# Altium project TC387_FOC.PrjPcb
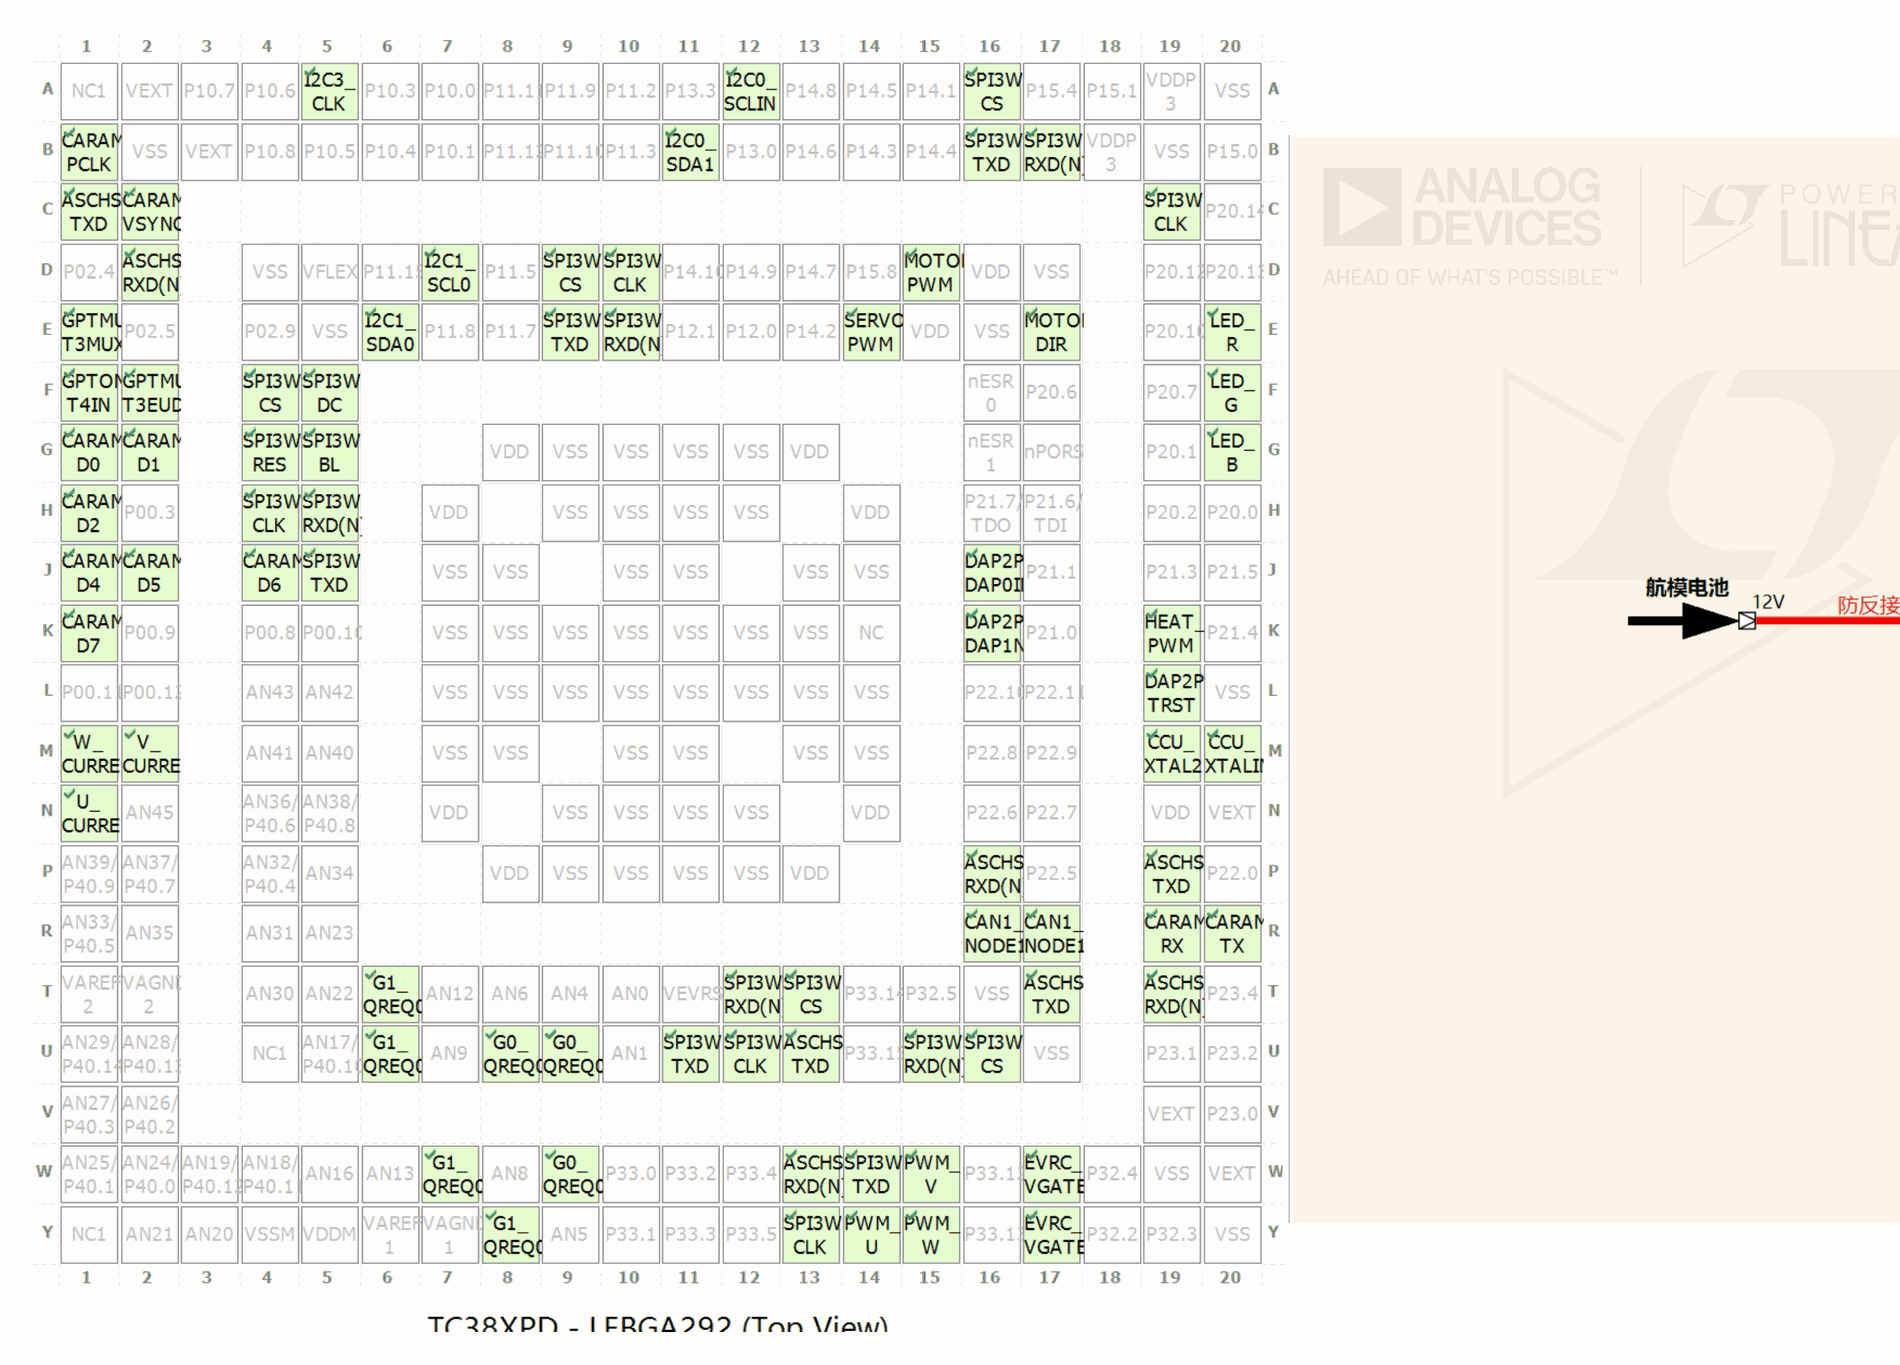
[diagram p0: TopDesign.SchDoc, left]
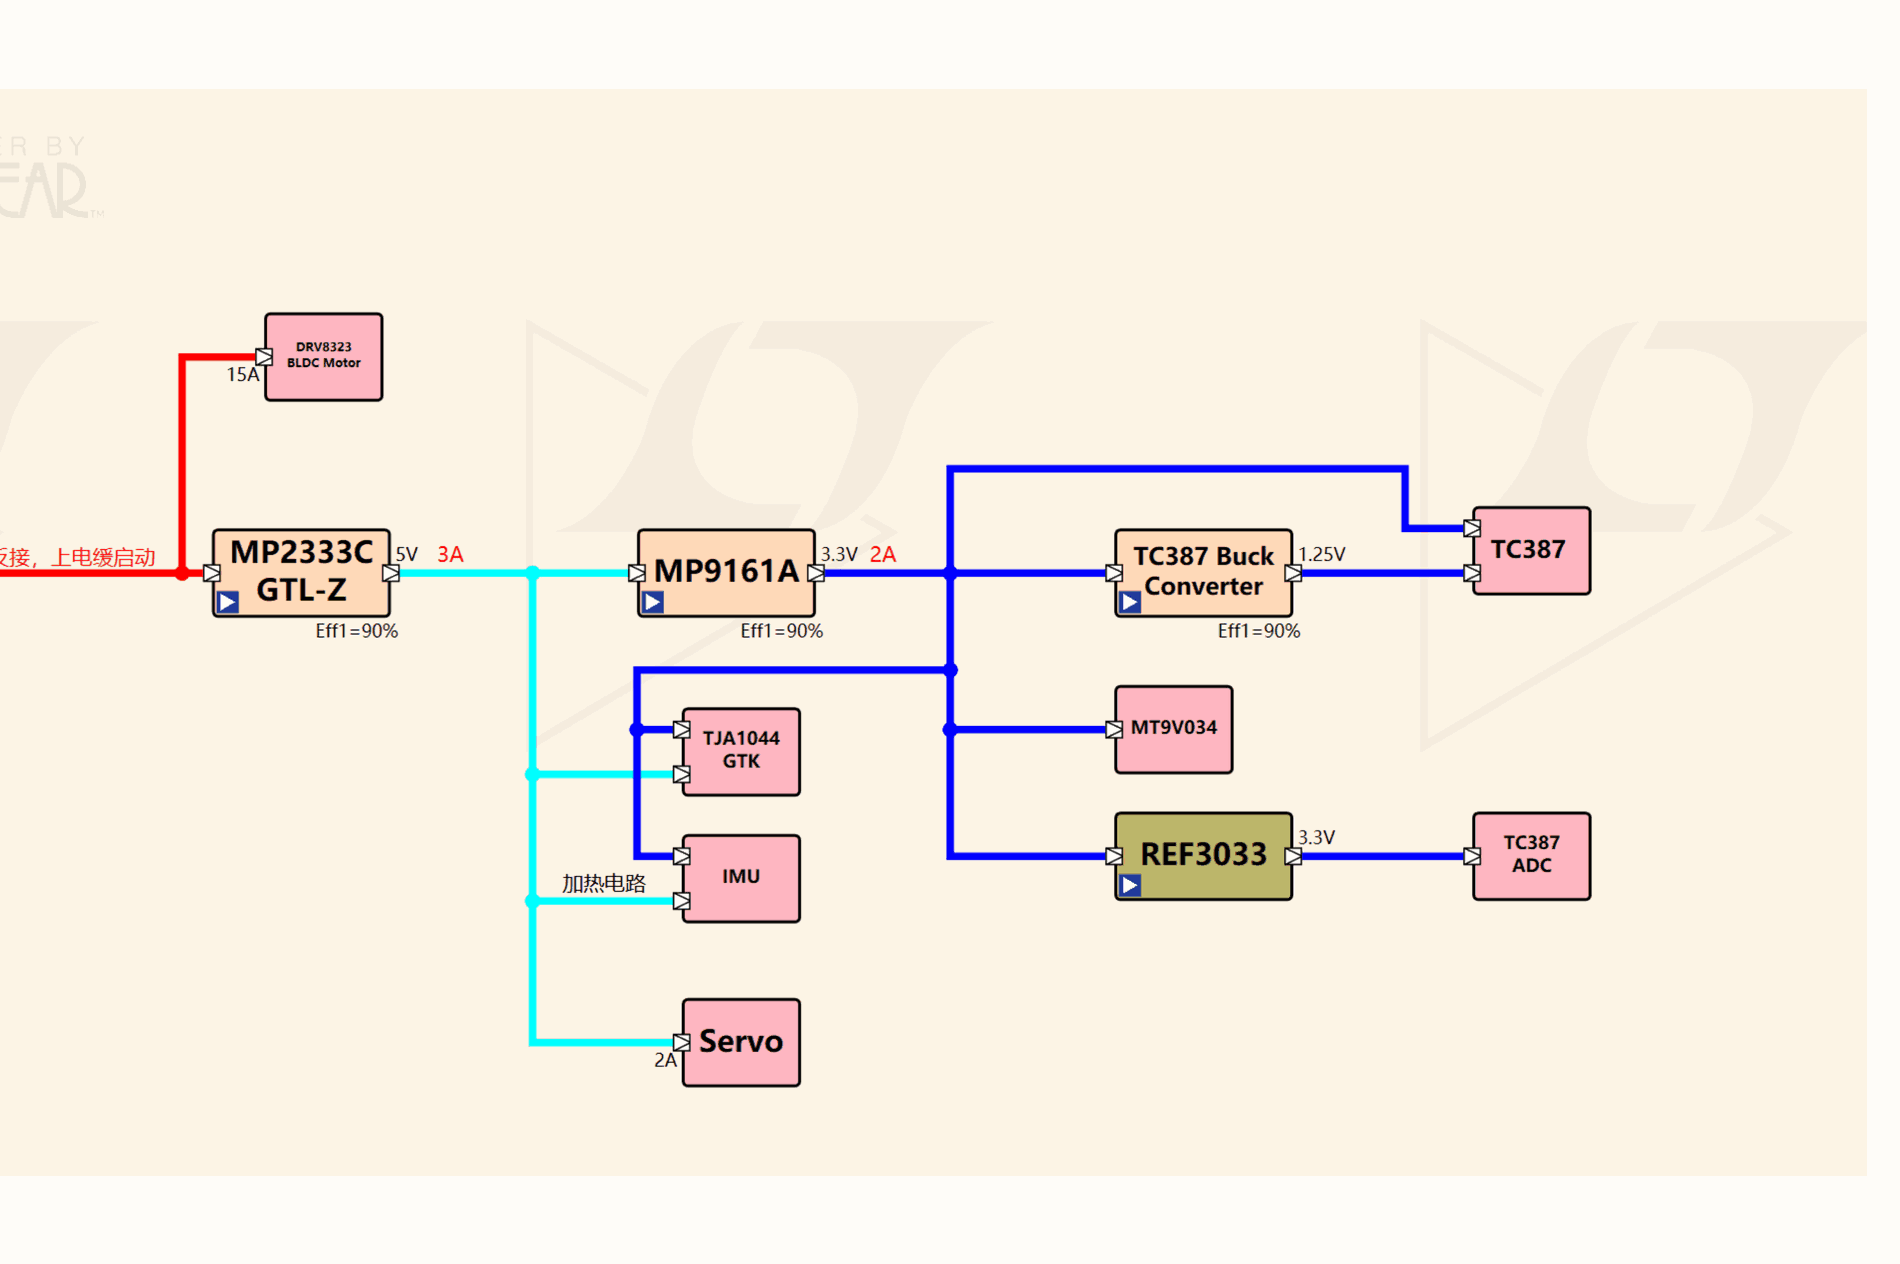
[diagram p1: TopDesign.SchDoc, right]
7 sheets, 210 parts. Net scope: global (net labels, ports and power ports of the same name join across sheets).
Board file: TC387_FOC.PcbDoc
Sheets:
  TopDesign.SchDoc
  PWR.SchDoc
  TC387_PWR.SchDoc
  TC387.SchDoc
  Carama.SchDoc
  Peripherals.SchDoc
  FOC.SchDoc

## Sheet TopDesign.SchDoc
size A1; SheetNumber: 4; SheetTotal: 6

## Sheet PWR.SchDoc
size A3; SheetNumber: 5; SheetTotal: 6
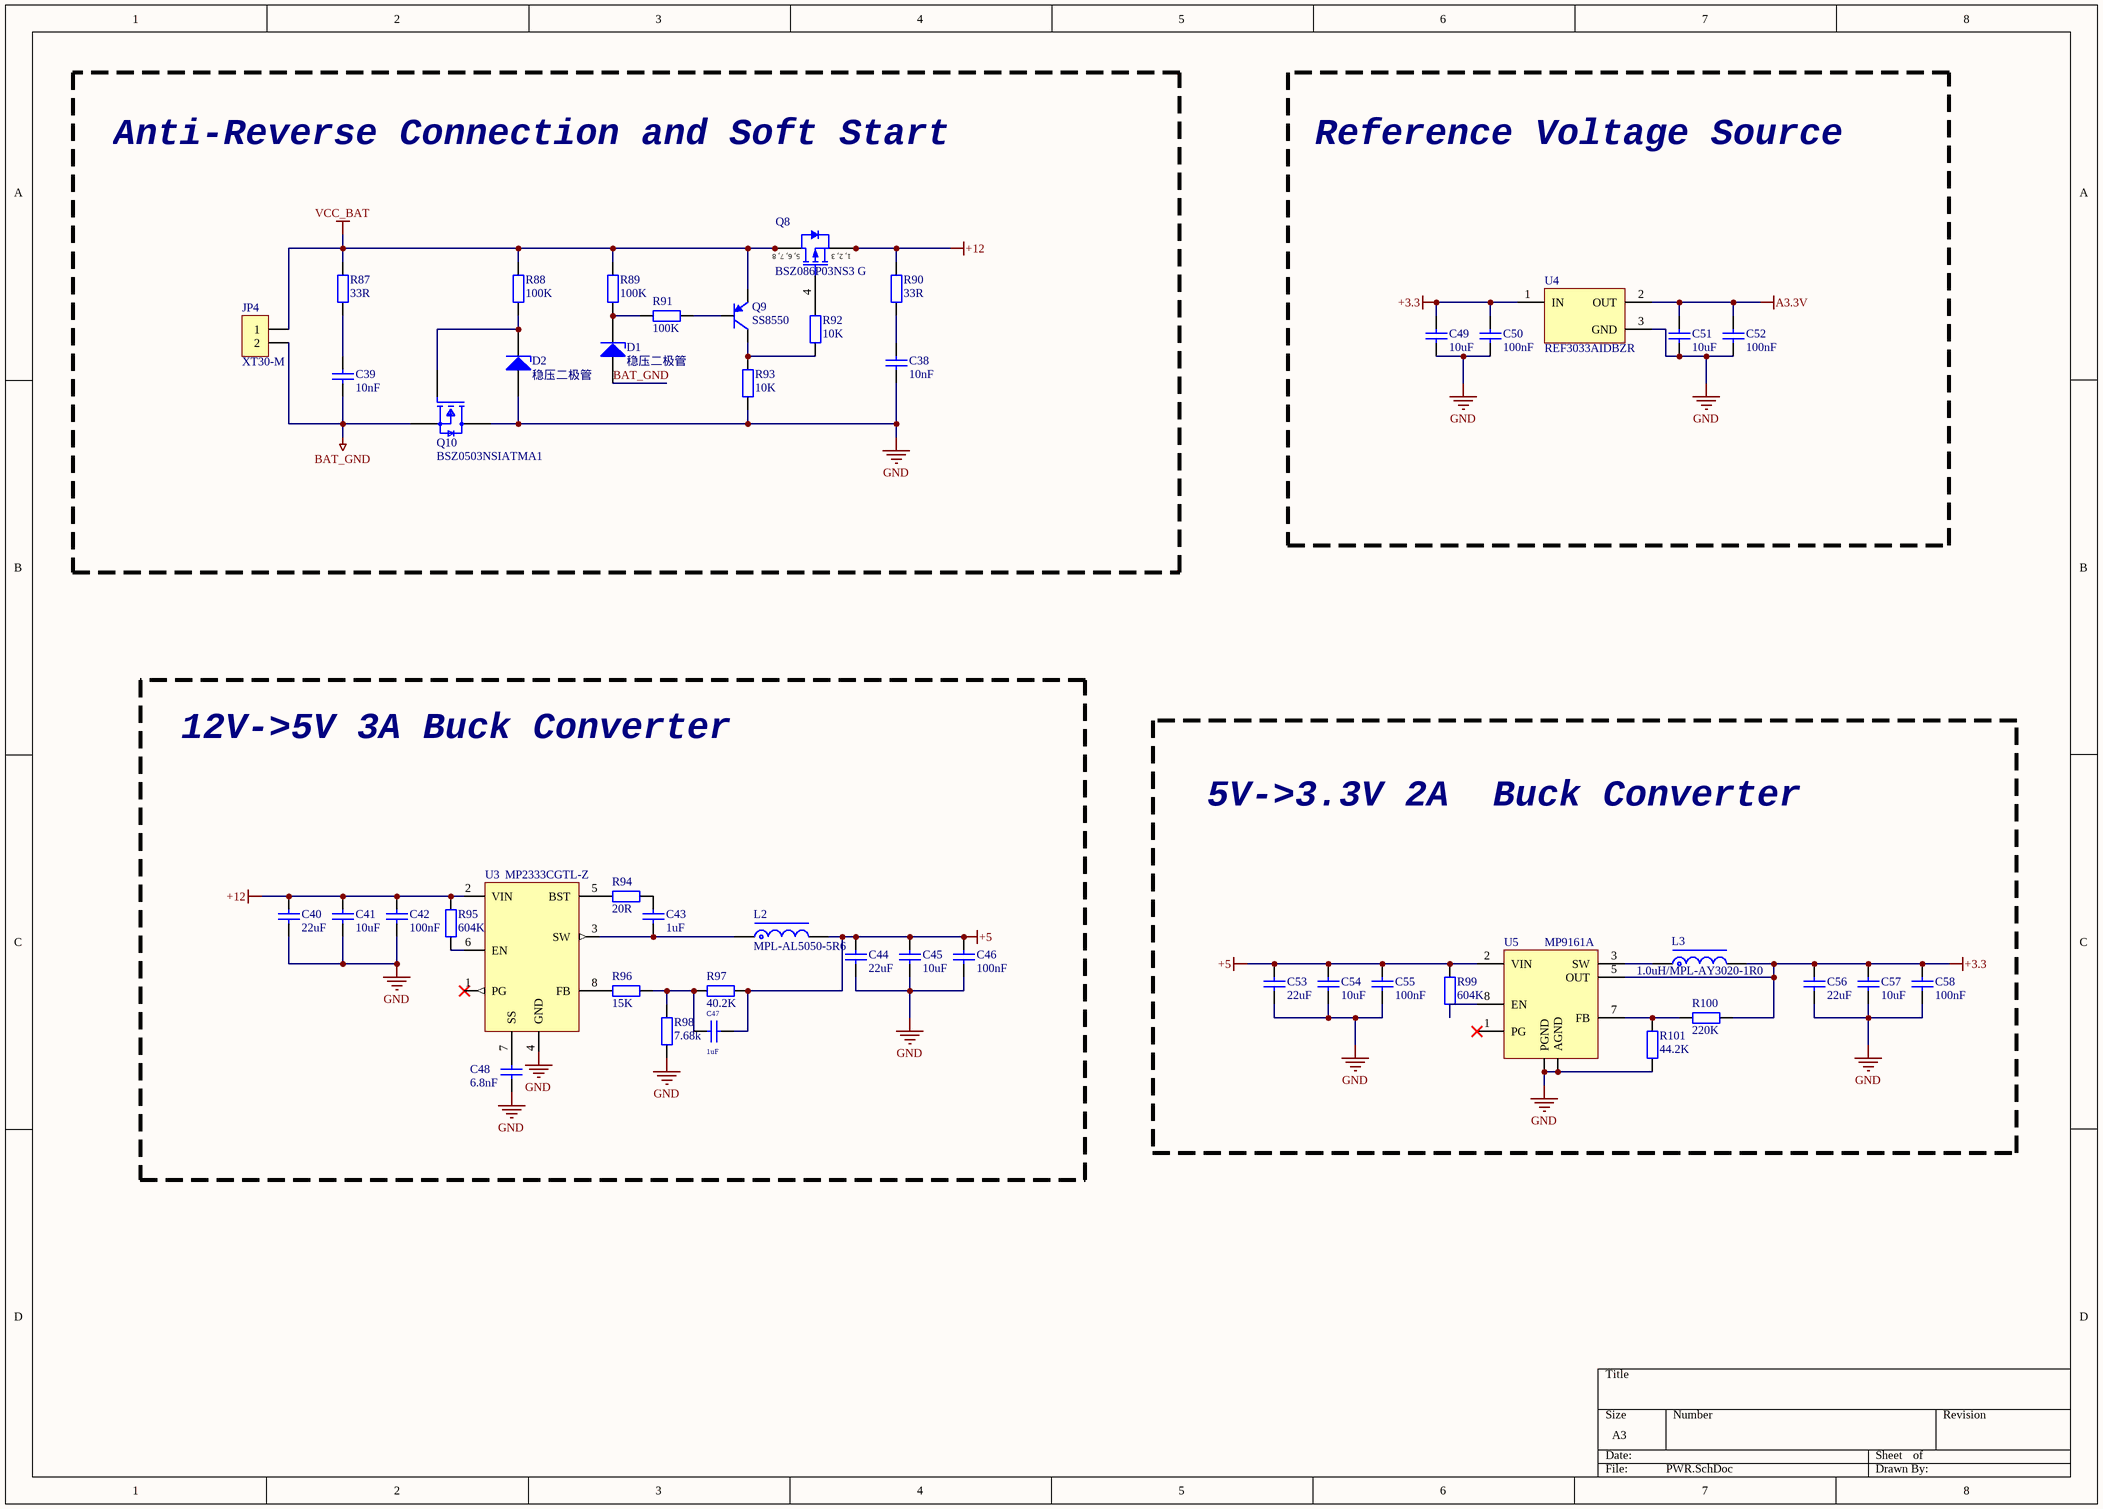
[diagram p2: PWR.SchDoc]

### Parts
C38  10nF  [C0402_M]
C39  10nF  [C0402_M]
C40  22uF  [C0402_M]
C41  10uF  [C0402_M]
C42  100nF  [C0402_M]
C43  1uF  [C0402_M]
C44  22uF  [C0402_M]
C45  10uF  [C0402_M]
C46  100nF  [C0402_M]
C47  1uF  [C0402_M]
C48  6.8nF  [C0402_M]
C49  10uF  [C0402_M]
C50  100nF  [C0402_M]
C51  10uF  [C0402_M]
C52  100nF  [C0402_M]
C53  22uF  [C0402_M]
C54  10uF  [C0402_M]
C55  100nF  [C0402_M]
C56  22uF  [C0402_M]
C57  10uF  [C0402_M]
C58  100nF  [C0402_M]
D1  稳压二极管  [SOD-523]
D2  稳压二极管  [SOD-523]
JP4  XT30-M  [XT30PB-M]
L2  MPL-AL5050-5R6  [MPL-AL5050]
L3  1.0uH/MPL-AY3020-1R0  [MPL-AY3020]
Q8  BSZ086P03NS3 G  [INF-PG-TSDSON-8-1_V]
Q9  SS8550  [SOT23-3N]
Q10  BSZ0503NSIATMA1  [FP-PG-TSDSON-8-MFG]
R87  33R  [R0402_L]
R88  100K  [R0402_L]
R89  100K  [R0402_L]
R90  33R  [R0402_L]
R91  100K  [R0402_L]
R92  10K  [R0402_L]
R93  10K  [R0402_L]
R94  20R  [R0402_L]
R95  604K  [R0402_L]
R96  15K  [R0402_L]
R97  40.2K  [R0402_L]
R98  7.68k  [R0402_L]
R99  604K  [R0402_L]
R100  220K  [R0402_L]
R101  44.2K  [R0402_L]
U3  MP2333CGTL-Z  [SOT583_MP2333C_MNP]
U4  REF3033AIDBZR  [DBZ0003A_N]
U5  MP9161A  [SOT23-8]

### Blocks framed on the sheet
Anti-Reverse Connection and Soft Start: C38 C39 D1 D2 JP4 Q8-Q10 R87-R93
Reference Voltage Source: C49-C52 U4
12V->5V 3A Buck Converter: C40-C48 L2 R94-R98 U3
5V->3.3V 2A  Buck Converter: C53-C58 L3 R99-R101 U5

### Nets
+3.3: C49.2 C50.2 C56.2 C57.2 C58.2 L3.2 R100.2 U4.1(IN) U5.5(OUT)
+5: C44.2 C45.2 C46.2 C47.1 C53.2 C54.2 C55.2 L2.2 R97.2 R99.2 U5.2(VIN)
+12: C40.2 C41.2 C42.2 Q8.1(SOURCE) Q8.2(SOURCE) Q8.3(SOURCE) R90.2 R95.2 U3.2(VIN)
A3.3V: C51.2 C52.2 U4.2(OUT)
BAT_GND: C39.1 D1.1(A) JP4.2 Q10.1-2-3(S)
GND: C38.1 C40.1 C41.1 C42.1 C44.1 C45.1 C46.1 C48.2 C49.1 C50.1 C51.1 C52.1 C53.1 C54.1 C55.1 C56.1 C57.1 C58.1 D2.1(A) Q10.5-6-7-8(D) R93.2 R98.2 R101.2 U3.4(GND) U4.3(GND) U5.4(PGND) U5.6(AGND)
VCC_BAT: JP4.1 Q8.5(DRAIN) Q8.6(DRAIN) Q8.7(DRAIN) Q8.8(DRAIN) Q9.2(E) R87.2 R88.2 R89.2
NetC38_2: C38.2 R90.1
NetC39_2: C39.2 R87.1
NetC43_1: C43.1 L2.1 U3.3(SW)
NetC43_2: C43.2 R94.1
NetC47_2: C47.2 R96.1 R97.1 R98.1
NetC48_1: C48.1 U3.7(SS)
NetD1_2: D1.2(K) R89.1 R91.2
NetD2_2: D2.2(K) Q10.4(G) R88.1
NetL3_1: L3.1 U5.3(SW)
NetQ8_4: Q8.4(GATE) R92.1
NetQ9_1: Q9.1(B) R91.1
NetQ9_3: Q9.3(C) R92.2 R93.1
NetR94_2: R94.2 U3.5(BST)
NetR95_1: R95.1 U3.6(EN)
NetR96_2: R96.2 U3.8(FB)
NetR99_1: R99.1 U5.8(EN)
NetR100_1: R100.1 R101.1 U5.7(FB)

Not connected (* = marked no-connect by the designer): U3 1(PG)*; U5 1(PG)*

### Notes on the sheet
- (in symbol CMP-1099-00063-1) 5, 6, 7, 8; 1, 2, 3

### Library data of the parts
C38-C58 = C: 贴片电容/MLCC电容; BOM名称: 无极性贴片电容; 当前库版本V2023.5.31 @淘宝卖家:黄晶宝石: 最新版本发布https://item.taobao.com/item.htm?id=566775463719
D1 D2 = 稳压二极管: Zener Diode; 当前库版本V2023.5.31 @淘宝卖家:黄晶宝石: 最新版本发布https://shop463601444.taobao.com
JP4 = XT30-M: XT30公头; 当前库版本V2023.5.31 @淘宝卖家:黄晶宝石: 最新版本发布https://shop463601444.taobao.com
L2 L3 = L-Molding Choke: 一体成型电感; 当前库版本V2023.5.31 @淘宝卖家:黄晶宝石: 最新版本发布https://item.taobao.com/item.htm?id=566775463719; BOM名称: 一体成型电感
Q8 = CMP-1099-00063-1: P-Channel OptiMOS P3 Power-Transistor, -30 V VDS, -40 A ID, -55 to 150 degC, PG-TSDSON-8-1, Reel, Green; Manufacturer: Infineon; RDS (on) (max): 8.6Â mOhm; Rth: 1.8Â K/W; QG: 43.2Â nC; VGS(th) (max): -1.9Â V; RthJC (max): 1.8 K/W; Green: TRUE; Pto t (max): 69Â W; ID (max): -40Â A; IDpuls (max): -160Â A; VDS (max): -30Â V; VGS(th) (min): -3.1Â V; ComponentLink1URL: http://www.infineon.com/; ComponentLink2URL: http://www.infineon.com/dgdl/BSZ086P03NS3+G_2.03.pdf?folderId=db3a304314dca38901154a7313d21a66&fileId=db3a30431ff9881501203d3a5e7d17a9; Mounting Technology: Surface Mount; PartNumber: BSZ086P03NS3 G; Packing: Reel; PackageVersion: Rev. 02, 09/2008; Halogen-free: TRUE; ComponentLink3URL: http://www.infineon.com/dgdl/BSZ240N12NS3+Rev2.0.pdf?folderId=db3a304313b8b5a60113cee8763b02d7&fileId=db3a30432a40a650012a42f3057a0038; PackageDescription: 8-Pin Plastic (Green) Thin Dual Small Outline Non-Leaded Package, 3.3 x 3.3 mm Body, 0.65 mm Pitch; PackageReference: PG-TSDSON-8-1; DatasheetVersion: Rev. 2.03; ComponentLink2Description: Datasheet; ComponentLink3Description: Package Specification; ComponentLink1Description: Manufacturer URL
Q9 = 8550-SMD: 高频放大-PNP型; 参数: 40V 1.5A 1W 100MHZ; 联系下单店铺卖家 免费帮你查找封装: 联系下单店铺卖家 免费技术支持; BOM名称: 高频放大-PNP型
Q10 = CMP-00066-1: BSZ0503NSI series 30V 40A 3.4 mOhm N-Ch S3O8 OptiMOS 5; Max Power Dissipation: 36W; Rds On Max: 3.4mR; Input Capacitance: 1.3nF; Mounting Technology: Surface Mount; Max Operating Temperature: 150°C; Halogen Free: Halogen Free; Series: OptiMOS™; Packaging: Tape and Reel; Pins: 8; Min Operating Temperature: -55°C; Drain to Source Voltage (Vdss): 30V; Lead Free: Contains Lead; Max Dual Supply Voltage: 30V; RoHS Compliant: Yes
R87-R101 = CMP-005-000000-2: 贴片电阻0; 联系下单店铺卖家 免费帮你查找封装: 联系下单店铺卖家 免费技术支持; BOM名称: 贴片电阻; Source: 0.1 - 电阻-电容-电感-保险丝-晶振-晶体-磁珠-电位器-法拉电容-馈通电容.SchLib; Design Item ID: R
U3 = CMP-00056-3: Switching Voltage Regulators 3A, 18V, 650kHz, Force CCM, Synchronous Step-Down C
U4 = CMP-0367-00170-2: 3.3 V, 50 ppm / degC, 50 uA Series (Bandgap) Voltage Reference, -40 to 125 degC, 3-pin SOT-23 (DBZ), Green (RoHS & no Sb/Br); Manufacturer: Texas Instruments; SubFamily: Series Voltage Reference; VO(V): 3.3; Rating: Catalog; VI(Max)(V): 5.5; Initial Accuracy @ 25/deg C(%): 0.2; VI(Min)(V): 3.301; Iq(Max)(uA): 50; Temp Coeff(Typ)(ppm/ degree C): 20; Eco-Plan: Green (RoHS & no Sb/Br); DatasheetVersion: SBVS032F; ComponentLink2URL: http://www.ti.com/general/docs/lit/getliterature.tsp?genericPartNumber=REF3033&fileType=pdf; Mounting Technology: Surface Mount; Code_JEDEC: TO-236; PackageDescription: 3-Pin Plastic Small Outline, Body 2.92 x 1.3 mm, Pitch 0.95 mm; PackageReference: DBZ0003A; ComponentLink1URL: http://www.ti.com/; ComponentLink3URL: http://www.ti.com/litv/pdf/mpds108a; PackageVersion: 4203227/B; ComponentLink3Description: Package Specification; PartNumber: REF3033AIDBZR; ComponentLink2Description: Datasheet; ComponentLink1Description: Manufacturer URL; Temp Coeff(Max)(ppm/ degree C): 50
U5 = CMP-00064-1

## Sheet TC387_PWR.SchDoc
size A3; SheetNumber: 2; SheetTotal: 6
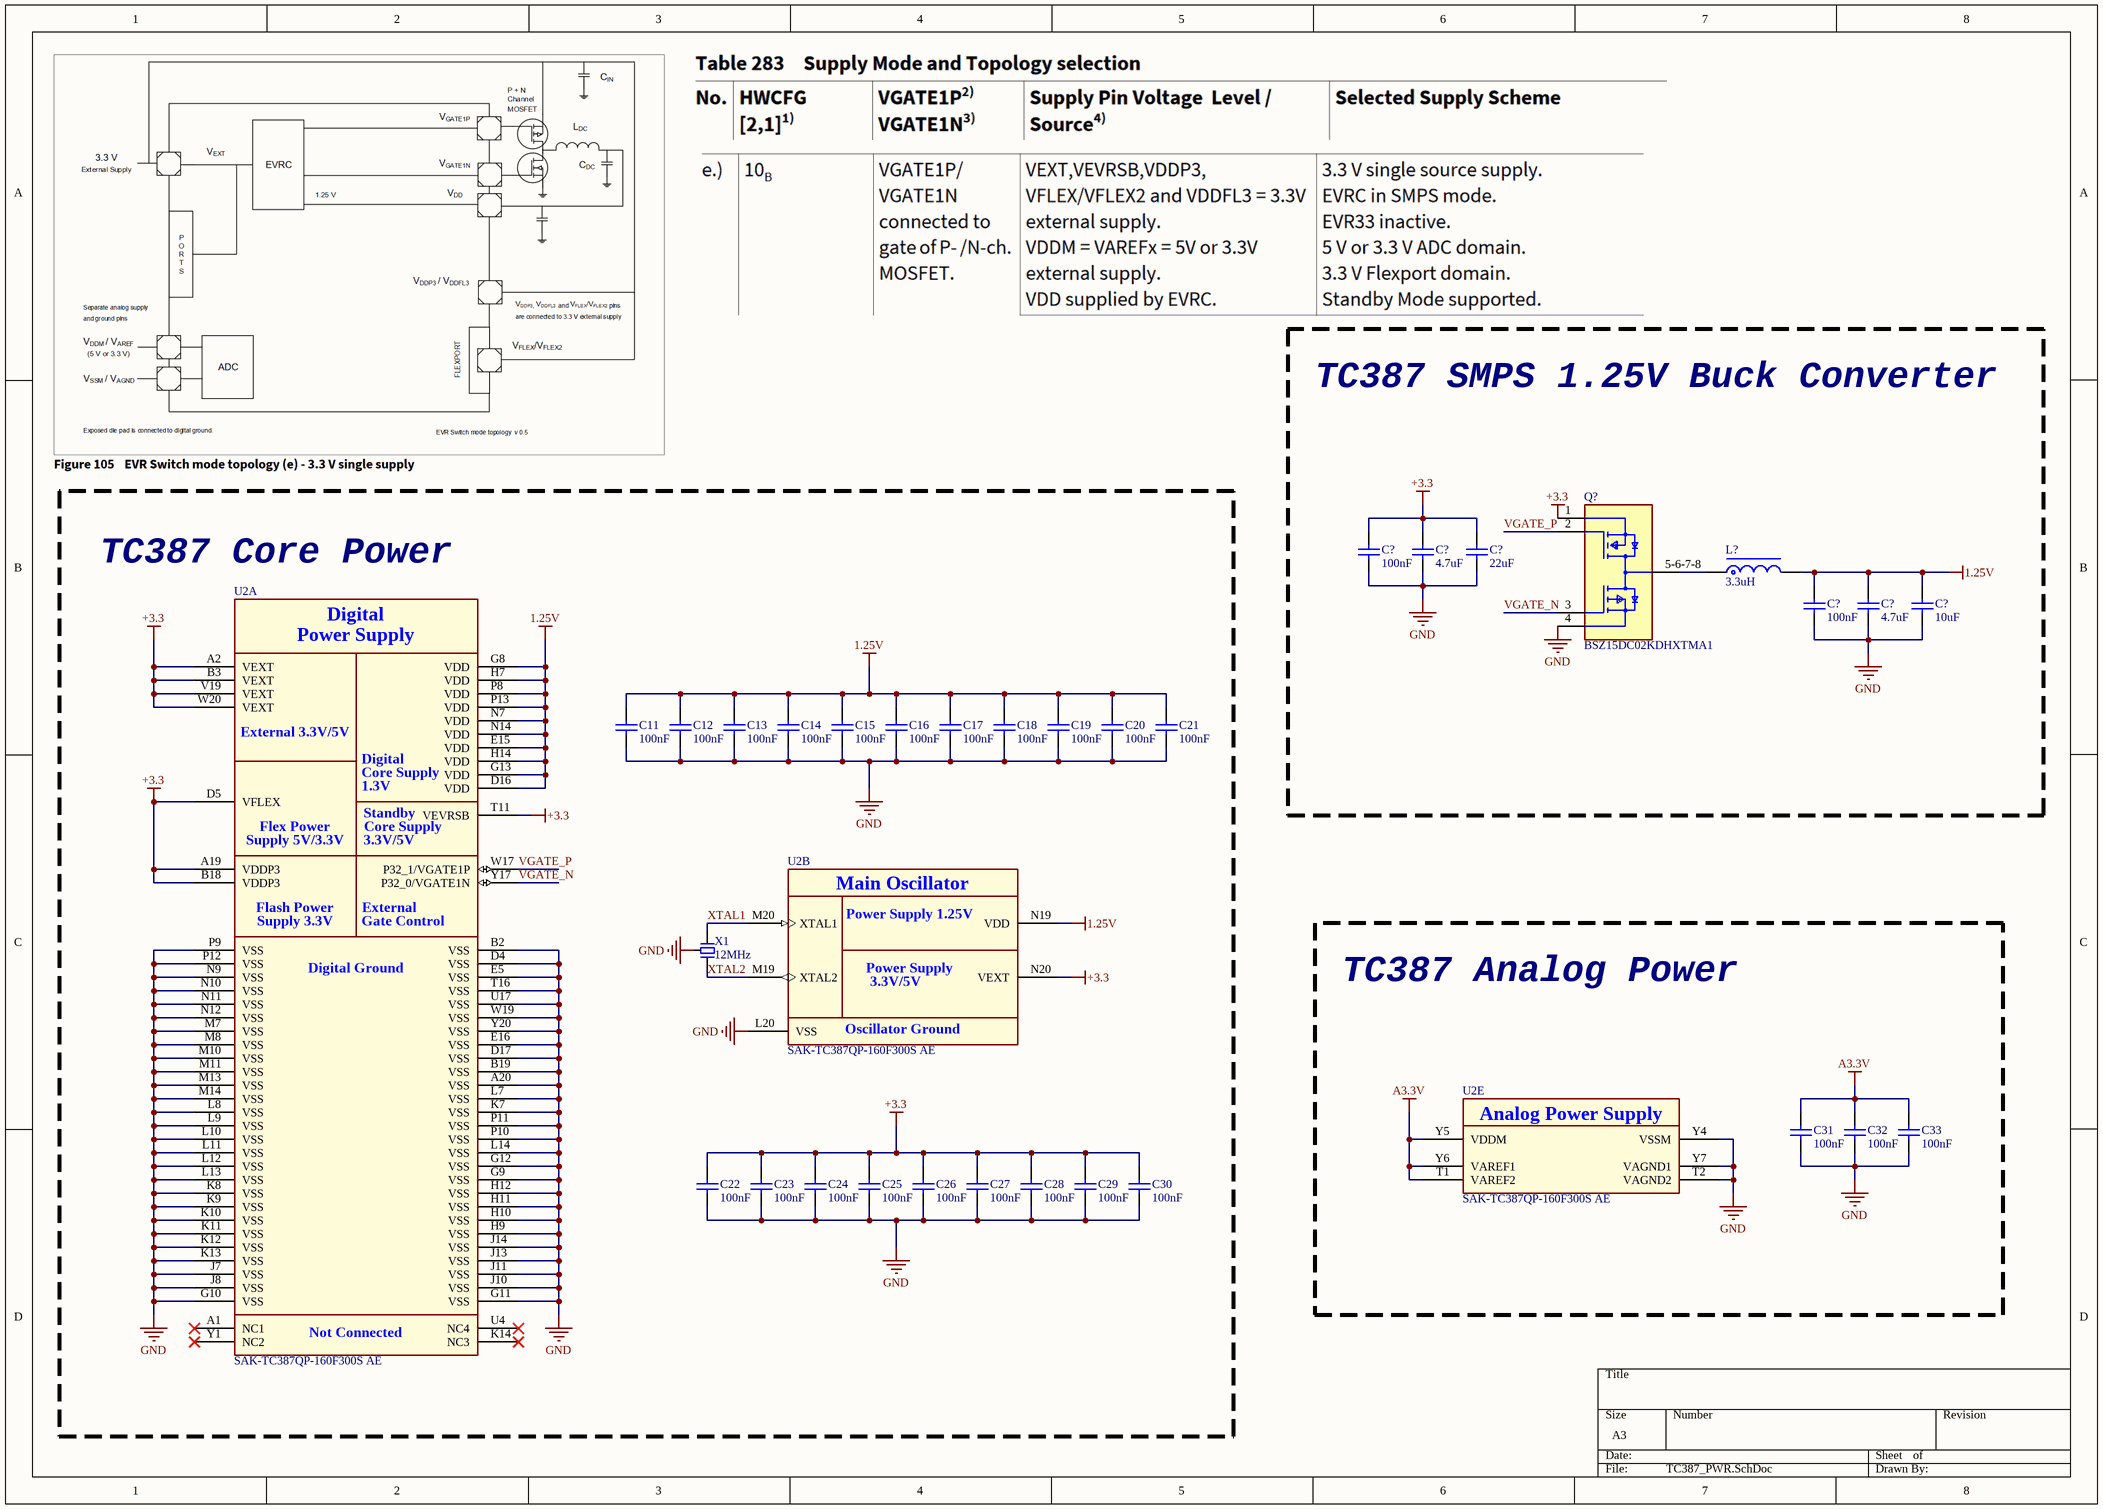
[diagram p3: TC387_PWR.SchDoc]

### Parts
(Parts that share a designator on the sheet are numbered #1, #2 ... from top to bottom, then left to right.)
C11  100nF  [C0402_M]
C12  100nF  [C0402_M]
C13  100nF  [C0402_M]
C14  100nF  [C0402_M]
C15  100nF  [C0402_M]
C16  100nF  [C0402_M]
C17  100nF  [C0402_M]
C18  100nF  [C0402_M]
C19  100nF  [C0402_M]
C20  100nF  [C0402_M]
C21  100nF  [C0402_M]
C22  100nF  [C0402_M]
C23  100nF  [C0402_M]
C24  100nF  [C0402_M]
C25  100nF  [C0402_M]
C26  100nF  [C0402_M]
C27  100nF  [C0402_M]
C28  100nF  [C0402_M]
C29  100nF  [C0402_M]
C30  100nF  [C0402_M]
C31  100nF  [C0603_L]
C32  100nF  [C0603_L]
C33  100nF  [C0603_L]
C?#1  100nF  [C0402_L]
C?#2  4.7uF  [C0402_L]
C?#3  22uF  [C0402_L]
C?#4  100nF  [C0603_L]
C?#5  4.7uF  [C0603_L]
C?#6  10uF  [C0603_L]
L?  3.3uH  [MPL-AY3020]
Q?  BSZ15DC02KDHXTMA1  [FP-PG-TSDSON-8-MFG]
U2  SAK-TC387QP-160F300S AE  [BGA292C80P20X20_1700X1700X170]  (parts A,B,E of 13)
X1  12MHz  [XTAL-3213-3P]

### Blocks framed on the sheet
TC387 SMPS 1.25V Buck Converter: C?#1-C?#6 L? Q?
TC387 Core Power: C11-C30 U2 X1
TC387 Analog Power: C31-C33 U2

### Nets
1.25V: C11.2 C12.2 C13.2 C14.2 C15.2 C16.2 C17.2 C18.2 C19.2 C20.2 C21.2 C?#4.2 C?#5.2 C?#6.2 L?.2 U2.D16(VDD) U2.E15(VDD) U2.G8(VDD) U2.G13(VDD) U2.H7(VDD) U2.H14(VDD) U2.N7(VDD) U2.N14(VDD) U2.N19(VDD) U2.P8(VDD) U2.P13(VDD)
+3.3: C22.2 C23.2 C24.2 C25.2 C26.2 C27.2 C28.2 C29.2 C30.2 C?#1.2 C?#2.2 C?#3.2 Q?.1(S1) U2.A2(VEXT) U2.A19(VDDP3) U2.B3(VEXT) U2.B18(VDDP3) U2.D5(VFLEX) U2.N20(VEXT) U2.T11(VEVRSB) U2.V19(VEXT) U2.W20(VEXT)
A3.3V: C31.2 C32.2 C33.2 U2.T1(VAREF2) U2.Y5(VDDM) U2.Y6(VAREF1)
GND: C11.1 C12.1 C13.1 C14.1 C15.1 C16.1 C17.1 C18.1 C19.1 C20.1 C21.1 C22.1 C23.1 C24.1 C25.1 C26.1 C27.1 C28.1 C29.1 C30.1 C31.1 C32.1 C33.1 C?#1.1 C?#2.1 C?#3.1 C?#4.1 C?#5.1 C?#6.1 Q?.4(S2) U2.A20(VSS) U2.B2(VSS) U2.B19(VSS) U2.D4(VSS) U2.D17(VSS) U2.E5(VSS) U2.E16(VSS) U2.G9(VSS) U2.G10(VSS) U2.G11(VSS) U2.G12(VSS) U2.H9(VSS) U2.H10(VSS) U2.H11(VSS) U2.H12(VSS) U2.J7(VSS) U2.J8(VSS) U2.J10(VSS) U2.J11(VSS) U2.J13(VSS) U2.J14(VSS) U2.K7(VSS) U2.K8(VSS) U2.K9(VSS) U2.K10(VSS) U2.K11(VSS) U2.K12(VSS) U2.K13(VSS) U2.L7(VSS) U2.L8(VSS) U2.L9(VSS) U2.L10(VSS) U2.L11(VSS) U2.L12(VSS) U2.L13(VSS) U2.L14(VSS) U2.L20(VSS) U2.M7(VSS) U2.M8(VSS) U2.M10(VSS) U2.M11(VSS) U2.M13(VSS) U2.M14(VSS) U2.N9(VSS) U2.N10(VSS) U2.N11(VSS) U2.N12(VSS) U2.P9(VSS) U2.P10(VSS) U2.P11(VSS) U2.P12(VSS) U2.T2(VAGND2) U2.T16(VSS) U2.U17(VSS) U2.W19(VSS) U2.Y4(VSSM) U2.Y7(VAGND1) U2.Y20(VSS) X1.2
VGATE_N: Q?.3(G2) U2.Y17(P32_0/VGATE1N)
VGATE_P: Q?.2(G1) U2.W17(P32_1/VGATE1P)
XTAL1: U2.M20(XTAL1) X1.1
XTAL2: U2.M19(XTAL2) X1.3
NetL?_1: L?.1 Q?.5-6-7-8(D1-D2)

Not connected (* = marked no-connect by the designer): U2 A1(NC1)* K14(NC3)* U4(NC4)* Y1(NC2)*

### Notes on the sheet
- (in symbol SAK-TC387QP-160F300S AE, part A) Digital; Power Supply; External 3.3V/5V; Core Supply; 1.3V; Standby; Flex Power; Supply 5V/3.3V; 3.3V/5V; Flash Power; External; Supply 3.3V; Gate Control; Digital Ground; Not Connected
- (in symbol SAK-TC387QP-160F300S AE, part B) Main Oscillator; Power Supply 1.25V; Power Supply; 3.3V/5V; Oscillator Ground
- (in symbol SAK-TC387QP-160F300S AE, part E) Analog Power Supply

### Library data of the parts
C11-C33 C?#1-C?#6 = C: as C38 on sheet PWR
L? = L-Molding Choke: as L2 on sheet PWR; BOM名称: 一体成型电感
Q? = CMP-32901-000666-1: MOSFET N/P-CH 20V 5.1/3.2A TDSON; Gate to Source Voltage (Vgs): 12V; Max Power Dissipation: 2.5W; Rds On Max: 55mR; Continuous Drain Current (ID): 3.2A; FET Type: N and P-Channel; Input Capacitance: 419pF; Max Operating Temperature: 175°C; Lead Free: Lead Free; Halogen Free: Halogen Free; Number of Pins: 8; Packaging: Tape and Reel; Min Operating Temperature: -55°C; Mount: Surface Mount; RoHS Compliant: Yes; Max Dual Supply Voltage: 20V; Drain to Source Voltage (Vdss): 20V
U2 = SAK-TC387QP-160F300S AE: 32-Bit Single-Chip Microcontroller; Manufacturer: Infineon Technologies; Manufacturer Order Number: SAK-TC387QP-160F300S AE; PackageReference: PG-LFBGA-292
X1 = XTAL-3P: 村田3脚无源晶振(谐振器）; BOM名称: 2脚无源晶振(谐振器）; 联系下单店铺卖家 免费帮你查找封装: 联系下单店铺卖家 免费技术支持

## Sheet TC387.SchDoc
size A3; SheetNumber: 3; SheetTotal: 6
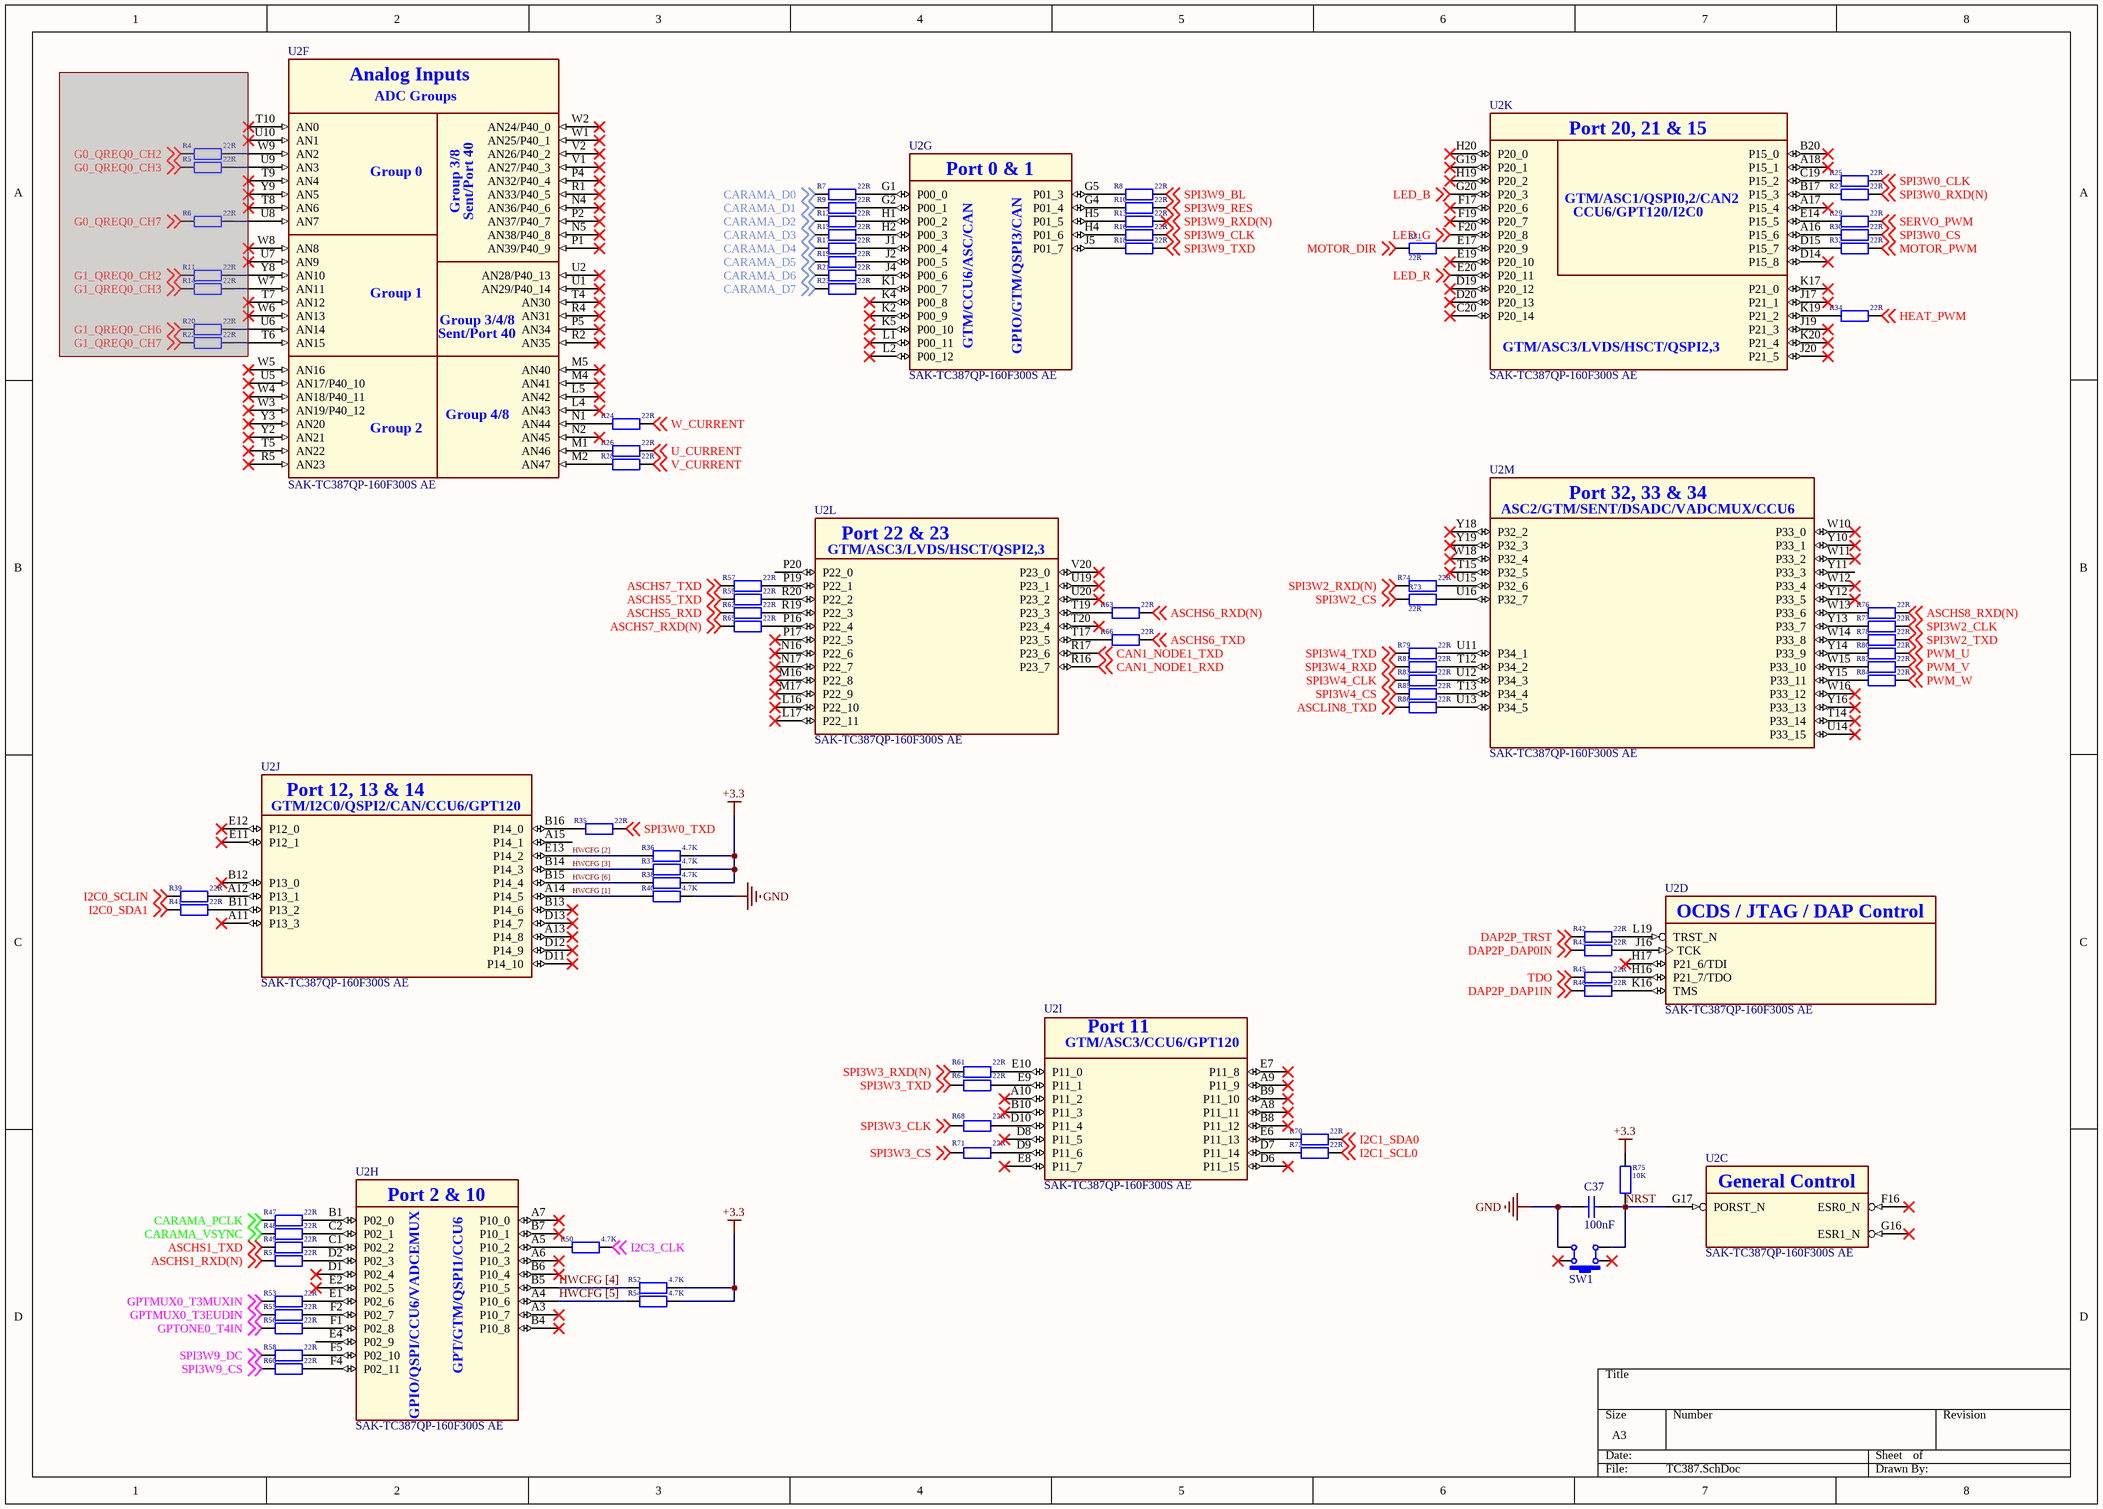
[diagram p4: TC387.SchDoc]

### Parts
C37  100nF  [C0402_L]
R4  22R  [R0402_L]  (masked out: inside a compile mask, not in the netlist)
R5  22R  [R0402_L]  (masked out: inside a compile mask, not in the netlist)
R6  22R  [R0402_L]  (masked out: inside a compile mask, not in the netlist)
R7  22R  [R0402_L]
R8  22R  [R0402_L]
R9  22R  [R0402_L]
R10  22R  [R0402_L]
R11  22R  [R0402_L]  (masked out: inside a compile mask, not in the netlist)
R12  22R  [R0402_L]
R13  22R  [R0402_L]
R14  22R  [R0402_L]  (masked out: inside a compile mask, not in the netlist)
R15  22R  [R0402_L]
R16  22R  [R0402_L]
R17  22R  [R0402_L]
R18  22R  [R0402_L]
R19  22R  [R0402_L]
R20  22R  [R0402_L]  (masked out: inside a compile mask, not in the netlist)
R21  22R  [R0402_L]
R22  22R  [R0402_L]  (masked out: inside a compile mask, not in the netlist)
R23  22R  [R0402_L]
R24  22R  [R0402_L]
R25  22R  [R0402_L]
R26  22R  [R0402_L]
R27  22R  [R0402_L]
R28  22R  [R0402_L]
R29  22R  [R0402_L]
R30  22R  [R0402_L]
R31  22R  [R0402_L]
R32  22R  [R0402_L]
R34  22R  [R0402_L]
R35  22R  [R0402_L]
R36  4.7K  [R0402_L]
R37  4.7K  [R0402_L]
R38  4.7K  [R0402_L]
R39  22R  [R0402_L]
R40  4.7K  [R0402_L]
R41  22R  [R0402_L]
R42  22R  [R0402_L]
R43  22R  [R0402_L]
R45  22R  [R0402_L]
R46  22R  [R0402_L]
R47  22R  [R0402_L]
R48  22R  [R0402_L]
R49  22R  [R0402_L]
R50  4.7K  [R0402_L]
R51  22R  [R0402_L]
R52  4.7K  [R0402_L]
R53  22R  [R0402_L]
R54  4.7K  [R0402_L]
R55  22R  [R0402_L]
R56  22R  [R0402_L]
R57  22R  [R0402_L]
R58  22R  [R0402_L]
R59  22R  [R0402_L]
R60  22R  [R0402_L]
R61  22R  [R0402_L]
R62  22R  [R0402_L]
R63  22R  [R0402_L]
R64  22R  [R0402_L]
R65  22R  [R0402_L]
R66  22R  [R0402_L]
R68  22R  [R0402_L]
R70  22R  [R0402_L]
R71  22R  [R0402_L]
R72  22R  [R0402_L]
R73  22R  [R0402_L]
R74  22R  [R0402_L]
R75  10K  [R0402_L]
R76  22R  [R0402_L]
R77  22R  [R0402_L]
R78  22R  [R0402_L]
R79  22R  [R0402_L]
R80  22R  [R0402_L]
R81  22R  [R0402_L]
R82  22R  [R0402_L]
R83  22R  [R0402_L]
R84  22R  [R0402_L]
R85  22R  [R0402_L]
R86  22R  [R0402_L]
SW1  TD-1187SA-250  [SW-SMD-3.5*3.0_4P]  (value not drawn)
U2  SAK-TC387QP-160F300S AE  [BGA292C80P20X20_1700X1700X170]  (parts C,D,F,G,H,I,J,K,L,M of 13)

### Nets
+3.3: R36.2 R37.2 R38.2 R52.2 R54.2 R75.1
GND: C37.2 R40.2 SW1.3
ASCHS1_RXD(N): R51.1 ; off-sheet ASCHS1_RXD(N)
ASCHS1_TXD: R49.1 ; off-sheet ASCHS1_TXD
ASCHS5_RXD: R62.1 ; off-sheet ASCHS5_RXD
ASCHS5_TXD: R59.1 ; off-sheet ASCHS5_TXD
ASCHS6_RXD(N): R63.2 ; off-sheet ASCHS6_RXD(N)
ASCHS6_TXD: R66.2 ; off-sheet ASCHS6_TXD
ASCHS7_RXD(N): R65.1 ; off-sheet ASCHS7_RXD(N)
ASCHS7_TXD: R57.1 ; off-sheet ASCHS7_TXD
ASCHS8_RXD(N): R76.2 ; off-sheet ASCHS8_RXD(N)
ASCLIN8_TXD: R86.1 ; off-sheet ASCLIN8_TXD
CAN1_NODE1_RXD: U2.R16(P23_7) ; off-sheet CAN1_NODE1_RXD
CAN1_NODE1_TXD: U2.R17(P23_6) ; off-sheet CAN1_NODE1_TXD
CARAMA_D0: R7.1 ; off-sheet CARAMA_D0
CARAMA_D1: R9.1 ; off-sheet CARAMA_D1
CARAMA_D2: R12.1 ; off-sheet CARAMA_D2
CARAMA_D3: R15.1 ; off-sheet CARAMA_D3
CARAMA_D4: R17.1 ; off-sheet CARAMA_D4
CARAMA_D5: R19.1 ; off-sheet CARAMA_D5
CARAMA_D6: R21.1 ; off-sheet CARAMA_D6
CARAMA_D7: R23.1 ; off-sheet CARAMA_D7
CARAMA_PCLK: R47.1 ; off-sheet CARAMA_PCLK
CARAMA_VSYNC: R48.1 ; off-sheet CARAMA_VSYNC
DAP2P_DAP0IN: R43.1 ; off-sheet DAP2P_DAP0IN
DAP2P_DAP1IN: R46.1 ; off-sheet DAP2P_DAP1IN
DAP2P_TRST: R42.1 ; off-sheet DAP2P_TRST
GPTMUX0_T3EUDIN: R55.1 ; off-sheet GPTMUX0_T3EUDIN
GPTMUX0_T3MUXIN: R53.1 ; off-sheet GPTMUX0_T3MUXIN
GPTONE0_T4IN: R56.1 ; off-sheet GPTONE0_T4IN
HEAT_PWM: R34.2 ; off-sheet HEAT_PWM
HWCFG [1]: R40.1 U2.A14(P14_5)
HWCFG [2]: R36.1 U2.E13(P14_2)
HWCFG [3]: R37.1 U2.B14(P14_3)
HWCFG [4]: R52.1 U2.B5(P10_5)
HWCFG [5]: R54.1 U2.A4(P10_6)
HWCFG [6]: R38.1 U2.B15(P14_4)
I2C0_SCLIN: R39.1 ; off-sheet I2C0_SCLIN
I2C0_SDA1: R41.1 ; off-sheet I2C0_SDA1
I2C1_SCL0: R72.2 ; off-sheet I2C1_SCL0
I2C1_SDA0: R70.2 ; off-sheet I2C1_SDA0
I2C3_CLK: R50.2 ; off-sheet I2C3_CLK
LED_B: U2.G20(P20_3) ; off-sheet LED_B
LED_G: U2.F20(P20_8) ; off-sheet LED_G
LED_R: U2.E20(P20_11) ; off-sheet LED_R
MOTOR_DIR: R31.2 ; off-sheet MOTOR_DIR
MOTOR_PWM: R32.2 ; off-sheet MOTOR_PWM
NRST: C37.1 R75.2 SW1.4 U2.G17(PORST_N)
PWM_U: R80.2 ; off-sheet PWM_U
PWM_V: R82.2 ; off-sheet PWM_V
PWM_W: R84.2 ; off-sheet PWM_W
SERVO_PWM: R29.2 ; off-sheet SERVO_PWM
SPI3W0_CLK: R25.2 ; off-sheet SPI3W0_CLK
SPI3W0_CS: R30.2 ; off-sheet SPI3W0_CS
SPI3W0_RXD(N): R27.2 ; off-sheet SPI3W0_RXD(N)
SPI3W0_TXD: R35.2 ; off-sheet SPI3W0_TXD
SPI3W2_CLK: R77.2 ; off-sheet SPI3W2_CLK
SPI3W2_CS: R73.1 ; off-sheet SPI3W2_CS
SPI3W2_RXD(N): R74.1 ; off-sheet SPI3W2_RXD(N)
SPI3W2_TXD: R78.2 ; off-sheet SPI3W2_TXD
SPI3W3_CLK: R68.2 ; off-sheet SPI3W3_CLK
SPI3W3_CS: R71.2 ; off-sheet SPI3W3_CS
SPI3W3_RXD(N): R61.2 ; off-sheet SPI3W3_RXD(N)
SPI3W3_TXD: R64.2 ; off-sheet SPI3W3_TXD
SPI3W4_CLK: R83.1 ; off-sheet SPI3W4_CLK
SPI3W4_CS: R85.1 ; off-sheet SPI3W4_CS
SPI3W4_RXD: R81.1 ; off-sheet SPI3W4_RXD
SPI3W4_TXD: R79.1 ; off-sheet SPI3W4_TXD
SPI3W9_BL: R8.2 ; off-sheet SPI3W9_BL
SPI3W9_CLK: R16.2 ; off-sheet SPI3W9_CLK
SPI3W9_CS: R60.1 ; off-sheet SPI3W9_CS
SPI3W9_DC: R58.1 ; off-sheet SPI3W9_DC
SPI3W9_RES: R10.2 ; off-sheet SPI3W9_RES
SPI3W9_RXD(N): R13.2 ; off-sheet SPI3W9_RXD(N)
SPI3W9_TXD: R18.2 ; off-sheet SPI3W9_TXD
TDO: R45.1 ; off-sheet TDO
U_CURRENT: R26.2 ; off-sheet U_CURRENT
V_CURRENT: R28.2 ; off-sheet V_CURRENT
W_CURRENT: R24.2 ; off-sheet W_CURRENT
NetR7_2: R7.2 U2.G1(P00_0)
NetR8_1: R8.1 U2.G5(P01_3)
NetR9_2: R9.2 U2.G2(P00_1)
NetR10_1: R10.1 U2.G4(P01_4)
NetR12_2: R12.2 U2.H1(P00_2)
NetR13_1: R13.1 U2.H5(P01_5)
NetR15_2: R15.2 U2.H2(P00_3)
NetR16_1: R16.1 U2.H4(P01_6)
NetR17_2: R17.2 U2.J1(P00_4)
NetR18_1: R18.1 U2.J5(P01_7)
NetR19_2: R19.2 U2.J2(P00_5)
NetR21_2: R21.2 U2.J4(P00_6)
NetR23_2: R23.2 U2.K1(P00_7)
NetR24_1: R24.1 U2.N1(AN44)
NetR25_1: R25.1 U2.C19(P15_2)
NetR26_1: R26.1 U2.M1(AN46)
NetR27_1: R27.1 U2.B17(P15_3)
NetR28_1: R28.1 U2.M2(AN47)
NetR29_1: R29.1 U2.E14(P15_5)
NetR30_1: R30.1 U2.A16(P15_6)
NetR31_1: R31.1 U2.E17(P20_9)
NetR32_1: R32.1 U2.D15(P15_7)
NetR34_1: R34.1 U2.K19(P21_2)
NetR35_1: R35.1 U2.B16(P14_0)
NetR39_2: R39.2 U2.A12(P13_1)
NetR41_2: R41.2 U2.B11(P13_2)
NetR42_2: R42.2 U2.L19(TRST_N)
NetR43_2: R43.2 U2.J16(TCK)
NetR45_2: R45.2 U2.H16(P21_7/TDO)
NetR46_2: R46.2 U2.K16(TMS)
NetR47_2: R47.2 U2.B1(P02_0)
NetR48_2: R48.2 U2.C2(P02_1)
NetR49_2: R49.2 U2.C1(P02_2)
NetR50_1: R50.1 U2.A5(P10_2)
NetR51_2: R51.2 U2.D2(P02_3)
NetR53_2: R53.2 U2.E1(P02_6)
NetR55_2: R55.2 U2.F2(P02_7)
NetR56_2: R56.2 U2.F1(P02_8)
NetR57_2: R57.2 U2.P19(P22_1)
NetR58_2: R58.2 U2.F5(P02_10)
NetR59_2: R59.2 U2.R20(P22_2)
NetR60_2: R60.2 U2.F4(P02_11)
NetR61_1: R61.1 U2.E10(P11_0)
NetR62_2: R62.2 U2.R19(P22_3)
NetR63_1: R63.1 U2.T19(P23_3)
NetR64_1: R64.1 U2.E9(P11_1)
NetR65_2: R65.2 U2.P16(P22_4)
NetR66_1: R66.1 U2.T17(P23_5)
NetR68_1: R68.1 U2.D10(P11_4)
NetR70_1: R70.1 U2.E6(P11_13)
NetR71_1: R71.1 U2.D9(P11_6)
NetR72_1: R72.1 U2.D7(P11_14)
NetR73_2: R73.2 U2.U16(P32_7)
NetR74_2: R74.2 U2.U15(P32_6)
NetR76_1: R76.1 U2.W13(P33_6)
NetR77_1: R77.1 U2.Y13(P33_7)
NetR78_1: R78.1 U2.W14(P33_8)
NetR79_2: R79.2 U2.U11(P34_1)
NetR80_1: R80.1 U2.Y14(P33_9)
NetR81_2: R81.2 U2.T12(P34_2)
NetR82_1: R82.1 U2.W15(P33_10)
NetR83_2: R83.2 U2.U12(P34_3)
NetR84_1: R84.1 U2.Y15(P33_11)
NetR85_2: R85.2 U2.T13(P34_4)
NetR86_2: R86.2 U2.U13(P34_5)

Not connected (* = marked no-connect by the designer): SW1 1* 2*; U2 A3(P10_7)* A6(P10_3)* A7(P10_0)* A8(P11_11)* A9(P11_9)* A10(P11_2)* A11(P13_3)* A13(P14_8)* A15(P14_1) A17(P15_4)* A18(P15_1)* B4(P10_8)* B6(P10_4)* B7(P10_1)* B8(P11_12)* B9(P11_10)* B10(P11_3)* B12(P13_0)* B13(P14_6)* B20(P15_0)* C20(P20_14)* D1(P02_4)* D6(P11_15)* D8(P11_5)* D11(P14_10)* D12(P14_9)* D13(P14_7)* D14(P15_8)* D19(P20_12)* D20(P20_13)* E2(P02_5)* E4(P02_9) E7(P11_8)* E8(P11_7)* E11(P12_1)* E12(P12_0)* E19(P20_10)* F16(ESR0_N)* F17(P20_6)* F19(P20_7)* G16(ESR1_N)* G19(P20_1)* H17(P21_6/TDI)* H19(P20_2)* H20(P20_0)* J17(P21_1)* J19(P21_3)* J20(P21_5)* K2(P00_9)* K4(P00_8)* K5(P00_10)* K17(P21_0)* K20(P21_4)* L1(P00_11)* L2(P00_12)* L4(AN43)* L5(AN42)* L16(P22_10)* L17(P22_11)* M4(AN41)* M5(AN40)* M16(P22_8)* M17(P22_9)* N2(AN45)* N4(AN36/P40_6)* N5(AN38/P40_8)* N16(P22_6)* N17(P22_7)* P1(AN39/P40_9)* P2(AN37/P40_7)* P4(AN32/P40_4)* P5(AN34)* P17(P22_5)* P20(P22_0) R1(AN33/P40_5)* R2(AN35)* R4(AN31)* R5(AN23)* T4(AN30)* T5(AN22)* T6(AN15) T7(AN12)* T8(AN6)* T9(AN4)* T10(AN0)* T14(P33_14)* T15(P32_5)* T20(P23_4)* U1(AN29/P40_14)* U2(AN28/P40_13)* U5(AN17/P40_10)* U6(AN14) U7(AN9)* U8(AN7) U9(AN3) U10(AN1)* U14(P33_15)* U19(P23_1)* U20(P23_2)* V1(AN27/P40_3)* V2(AN26/P40_2)* V20(P23_0)* W1(AN25/P40_1)* W2(AN24/P40_0)* W3(AN19/P40_12)* W4(AN18/P40_11)* W5(AN16)* W6(AN13)* W7(AN11) W8(AN8)* W9(AN2) W10(P33_0)* W11(P33_2)* W12(P33_4)* W16(P33_12)* W18(P32_4)* Y2(AN21)* Y3(AN20)* Y8(AN10) Y9(AN5)* Y10(P33_1)* Y11(P33_3) Y12(P33_5)* Y16(P33_13)* Y18(P32_2)* Y19(P32_3)*

### Notes on the sheet
- (in symbol SAK-TC387QP-160F300S AE, part C) General Control
- (in symbol SAK-TC387QP-160F300S AE, part D) OCDS / JTAG / DAP Control
- (in symbol SAK-TC387QP-160F300S AE, part F) Analog Inputs; ADC Groups; Group 0; Group 3/8; Sent/Port 40; Group 1; Group 3/4/8; Group 4/8; Group 2
- (in symbol SAK-TC387QP-160F300S AE, part G) Port 0 & 1; GTM/CCU6/ASC/CAN; GPIO/GTM/QSPI3/CAN
- (in symbol SAK-TC387QP-160F300S AE, part H) Port 2 & 10; GPT/GTM/QSPI1/CCU6; GPIO/QSPI/CCU6/VADCEMUX
- (in symbol SAK-TC387QP-160F300S AE, part I) Port 11; GTM/ASC3/CCU6/GPT120
- (in symbol SAK-TC387QP-160F300S AE, part J) Port 12, 13 & 14; GTM/I2C0/QSPI2/CAN/CCU6/GPT120
- (in symbol SAK-TC387QP-160F300S AE, part K) Port 20, 21 & 15; GTM/ASC1/QSPI0,2/CAN2; CCU6/GPT120/I2C0; GTM/ASC3/LVDS/HSCT/QSPI2,3
- (in symbol SAK-TC387QP-160F300S AE, part L) Port 22 & 23; GTM/ASC3/LVDS/HSCT/QSPI2,3
- (in symbol SAK-TC387QP-160F300S AE, part M) Port 32, 33 & 34; ASC2/GTM/SENT/DSADC/VADCMUX/CCU6

### Library data of the parts
C37 = CMP-002-000000-1: 贴片电容/MLCC电容; BOM名称: 无极性贴片电容; 当前库版本V2023.5.31 @淘宝卖家:黄晶宝石: 最新版本发布https://item.taobao.com/item.htm?id=566775463719; Design Item ID: C; Source: 0.1 - 电阻-电容-电感-保险丝-晶振-晶体-磁珠-电位器-法拉电容-馈通电容.SchLib
R4-R32 R34-R43 R45-R66 R68 R70-R86 = R: 贴片电阻; 联系下单店铺卖家 免费帮你查找封装: 联系下单店铺卖家 免费技术支持; BOM名称: 贴片电阻
SW1 = TD-1187SA-250: 小乌龟-侧按4脚开关 带定位柱; 联系下单店铺卖家 免费技术支持: 联系下单店铺卖家 免费帮你查找封装
U2 = SAK-TC387QP-160F300S AE: as U2 on sheet TC387_PWR; Manufacturer Order Number: SAK-TC387QP-160F300S AE; PackageReference: PG-LFBGA-292

## Sheet Carama.SchDoc
size A3; SheetNumber: 6; SheetTotal: 7
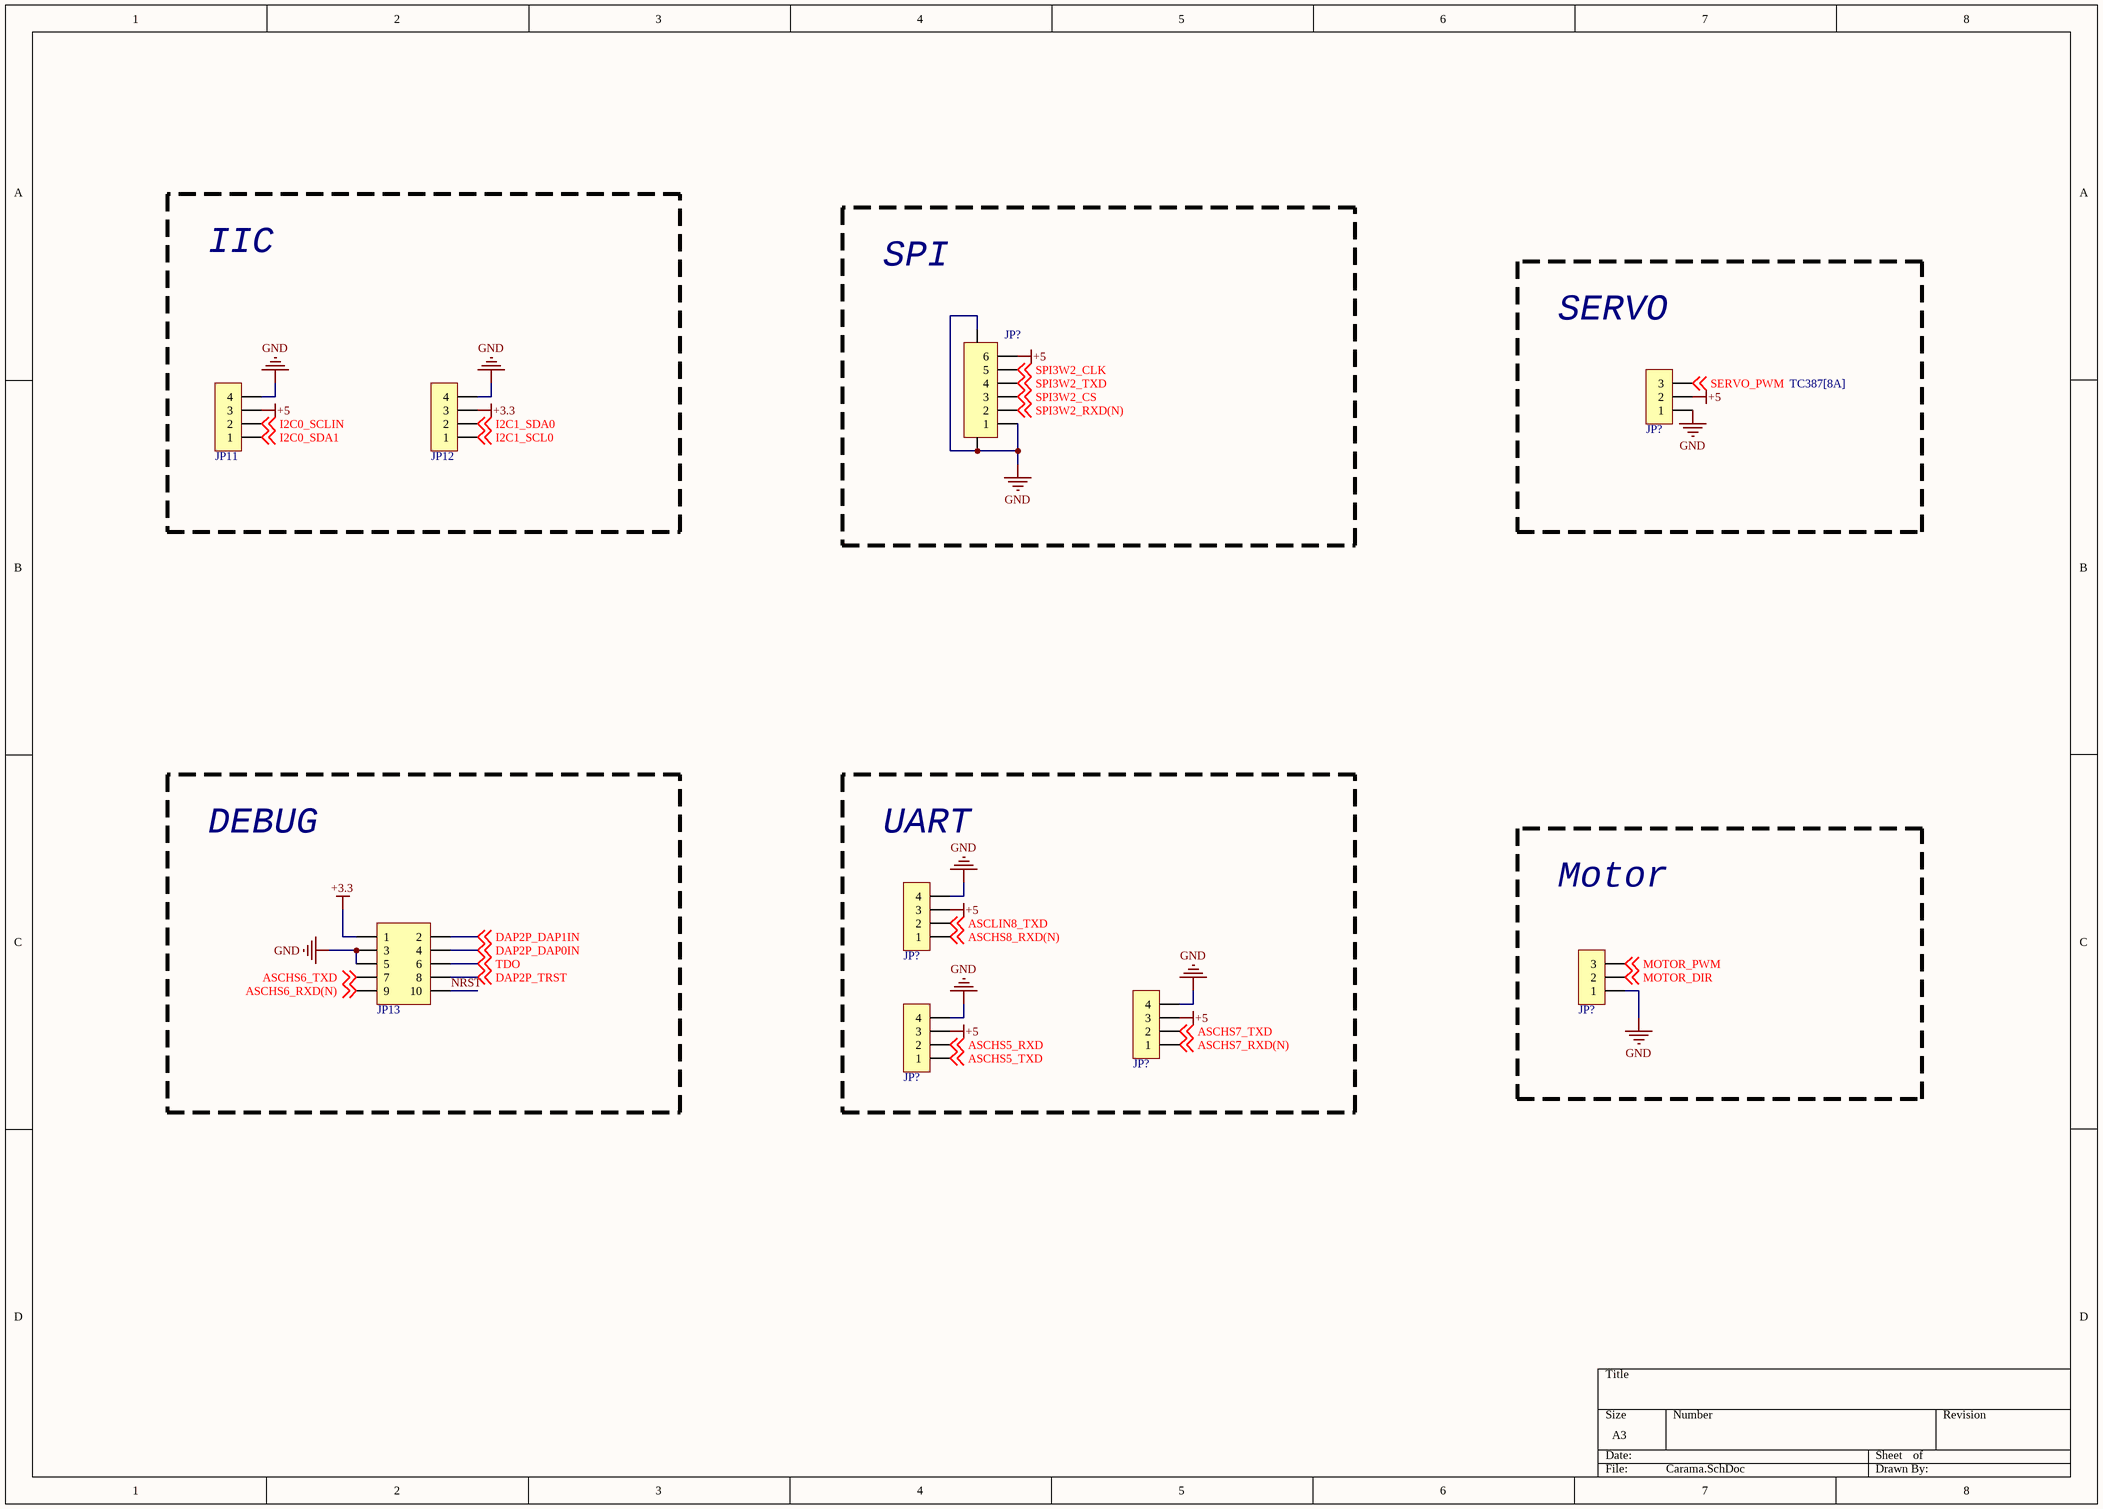
[diagram p5: Carama.SchDoc]

### Parts
(Parts that share a designator on the sheet are numbered #1, #2 ... from top to bottom, then left to right.)
JP11  HDR-1X4  [GH1.25-WT-4P]  (value not drawn)
JP12  HDR-1X4  [GH1.25-WT-4P]  (value not drawn)
JP13  Header 5X2  [HDR2.54-LI-2x5P]  (value not drawn)
JP?#1  HDR-1X3  [HDR2.54-LI-3P]  (value not drawn)
JP?#2  CON-6P  [SH1.0-WT-6P]  (value not drawn)
JP?#3  HDR-1X4  [GH1.25-WT-4P]  (value not drawn)
JP?#4  HDR-1X3  [GH1.25-LT-3P]  (value not drawn)
JP?#5  HDR-1X4  [GH1.25-WT-4P]  (value not drawn)
JP?#6  HDR-1X4  [GH1.25-WT-4P]  (value not drawn)

### Blocks framed on the sheet
IIC: JP11 JP12
SPI: JP?#2
SERVO: JP?#1
DEBUG: JP13
UART: JP?#3 JP?#5 JP?#6
Motor: JP?#4

### Nets
+3.3: JP12.3 JP13.1
+5: JP11.3 JP?#1.2 JP?#2.6 JP?#3.3 JP?#5.3 JP?#6.3
GND: JP11.4 JP12.4 JP13.3 JP13.5 JP?#1.1 JP?#2.0 JP?#2.1 JP?#3.4 JP?#4.1 JP?#5.4 JP?#6.4
ASCHS5_RXD: JP?#6.2 ; off-sheet ASCHS5_RXD
ASCHS5_TXD: JP?#6.1 ; off-sheet ASCHS5_TXD
ASCHS6_RXD(N): JP13.9 ; off-sheet ASCHS6_RXD(N)
ASCHS6_TXD: JP13.7 ; off-sheet ASCHS6_TXD
ASCHS7_RXD(N): JP?#5.1 ; off-sheet ASCHS7_RXD(N)
ASCHS7_TXD: JP?#5.2 ; off-sheet ASCHS7_TXD
ASCHS8_RXD(N): JP?#3.1 ; off-sheet ASCHS8_RXD(N)
ASCLIN8_TXD: JP?#3.2 ; off-sheet ASCLIN8_TXD
DAP2P_DAP0IN: JP13.4 ; off-sheet DAP2P_DAP0IN
DAP2P_DAP1IN: JP13.2 ; off-sheet DAP2P_DAP1IN
DAP2P_TRST: JP13.8 ; off-sheet DAP2P_TRST
I2C0_SCLIN: JP11.2 ; off-sheet I2C0_SCLIN
I2C0_SDA1: JP11.1 ; off-sheet I2C0_SDA1
I2C1_SCL0: JP12.1 ; off-sheet I2C1_SCL0
I2C1_SDA0: JP12.2 ; off-sheet I2C1_SDA0
MOTOR_DIR: JP?#4.2 ; off-sheet MOTOR_DIR
MOTOR_PWM: JP?#4.3 ; off-sheet MOTOR_PWM
NRST: JP13.10
SERVO_PWM: JP?#1.3 ; off-sheet SERVO_PWM
SPI3W2_CLK: JP?#2.5 ; off-sheet SPI3W2_CLK
SPI3W2_CS: JP?#2.3 ; off-sheet SPI3W2_CS
SPI3W2_RXD(N): JP?#2.2 ; off-sheet SPI3W2_RXD(N)
SPI3W2_TXD: JP?#2.4 ; off-sheet SPI3W2_TXD
TDO: JP13.6 ; off-sheet TDO

### Library data of the parts
JP11 JP12 JP?#3 JP?#5 JP?#6 = Header 4: 4P连接器; 联系卖家 免费技术支持: 封装库来自淘宝卖家ID：黄晶宝石; BOM名称: 4P连接器
JP13 = Header 5X2: 5*2P接插件; 联系卖家，免费查找封装: 唯一出售店铺网址https://shop463601444.taobao.com; 封装库来自淘宝卖家ID：黄晶宝石: 其他店铺购入均为盗版封装库，请立即申请退款，本店现金奖励50~200元; BOM名称: 5*2P接插件
JP?#1 = Header 3: 3P接插件; 联系卖家，免费查找封装: 唯一出售店铺网址https://shop463601444.taobao.com; 封装库来自淘宝卖家ID：黄晶宝石: 其他店铺购入均为盗版封装库，请立即申请退款，本店现金奖励50~200元; BOM名称: 3P接插件
JP?#2 = Header 6: 6P连接器; 封装库来自淘宝卖家：黄晶宝石: 获取最新版本https://shop463601444.taobao.com; BOM名称: 6P连接器
JP?#4 = Header 3: 3P连接器; 联系卖家 免费技术支持: 封装库来自淘宝卖家ID：黄晶宝石; BOM名称: 3P连接器

## Sheet Peripherals.SchDoc
size A3; SheetNumber: 7; SheetTotal: 6
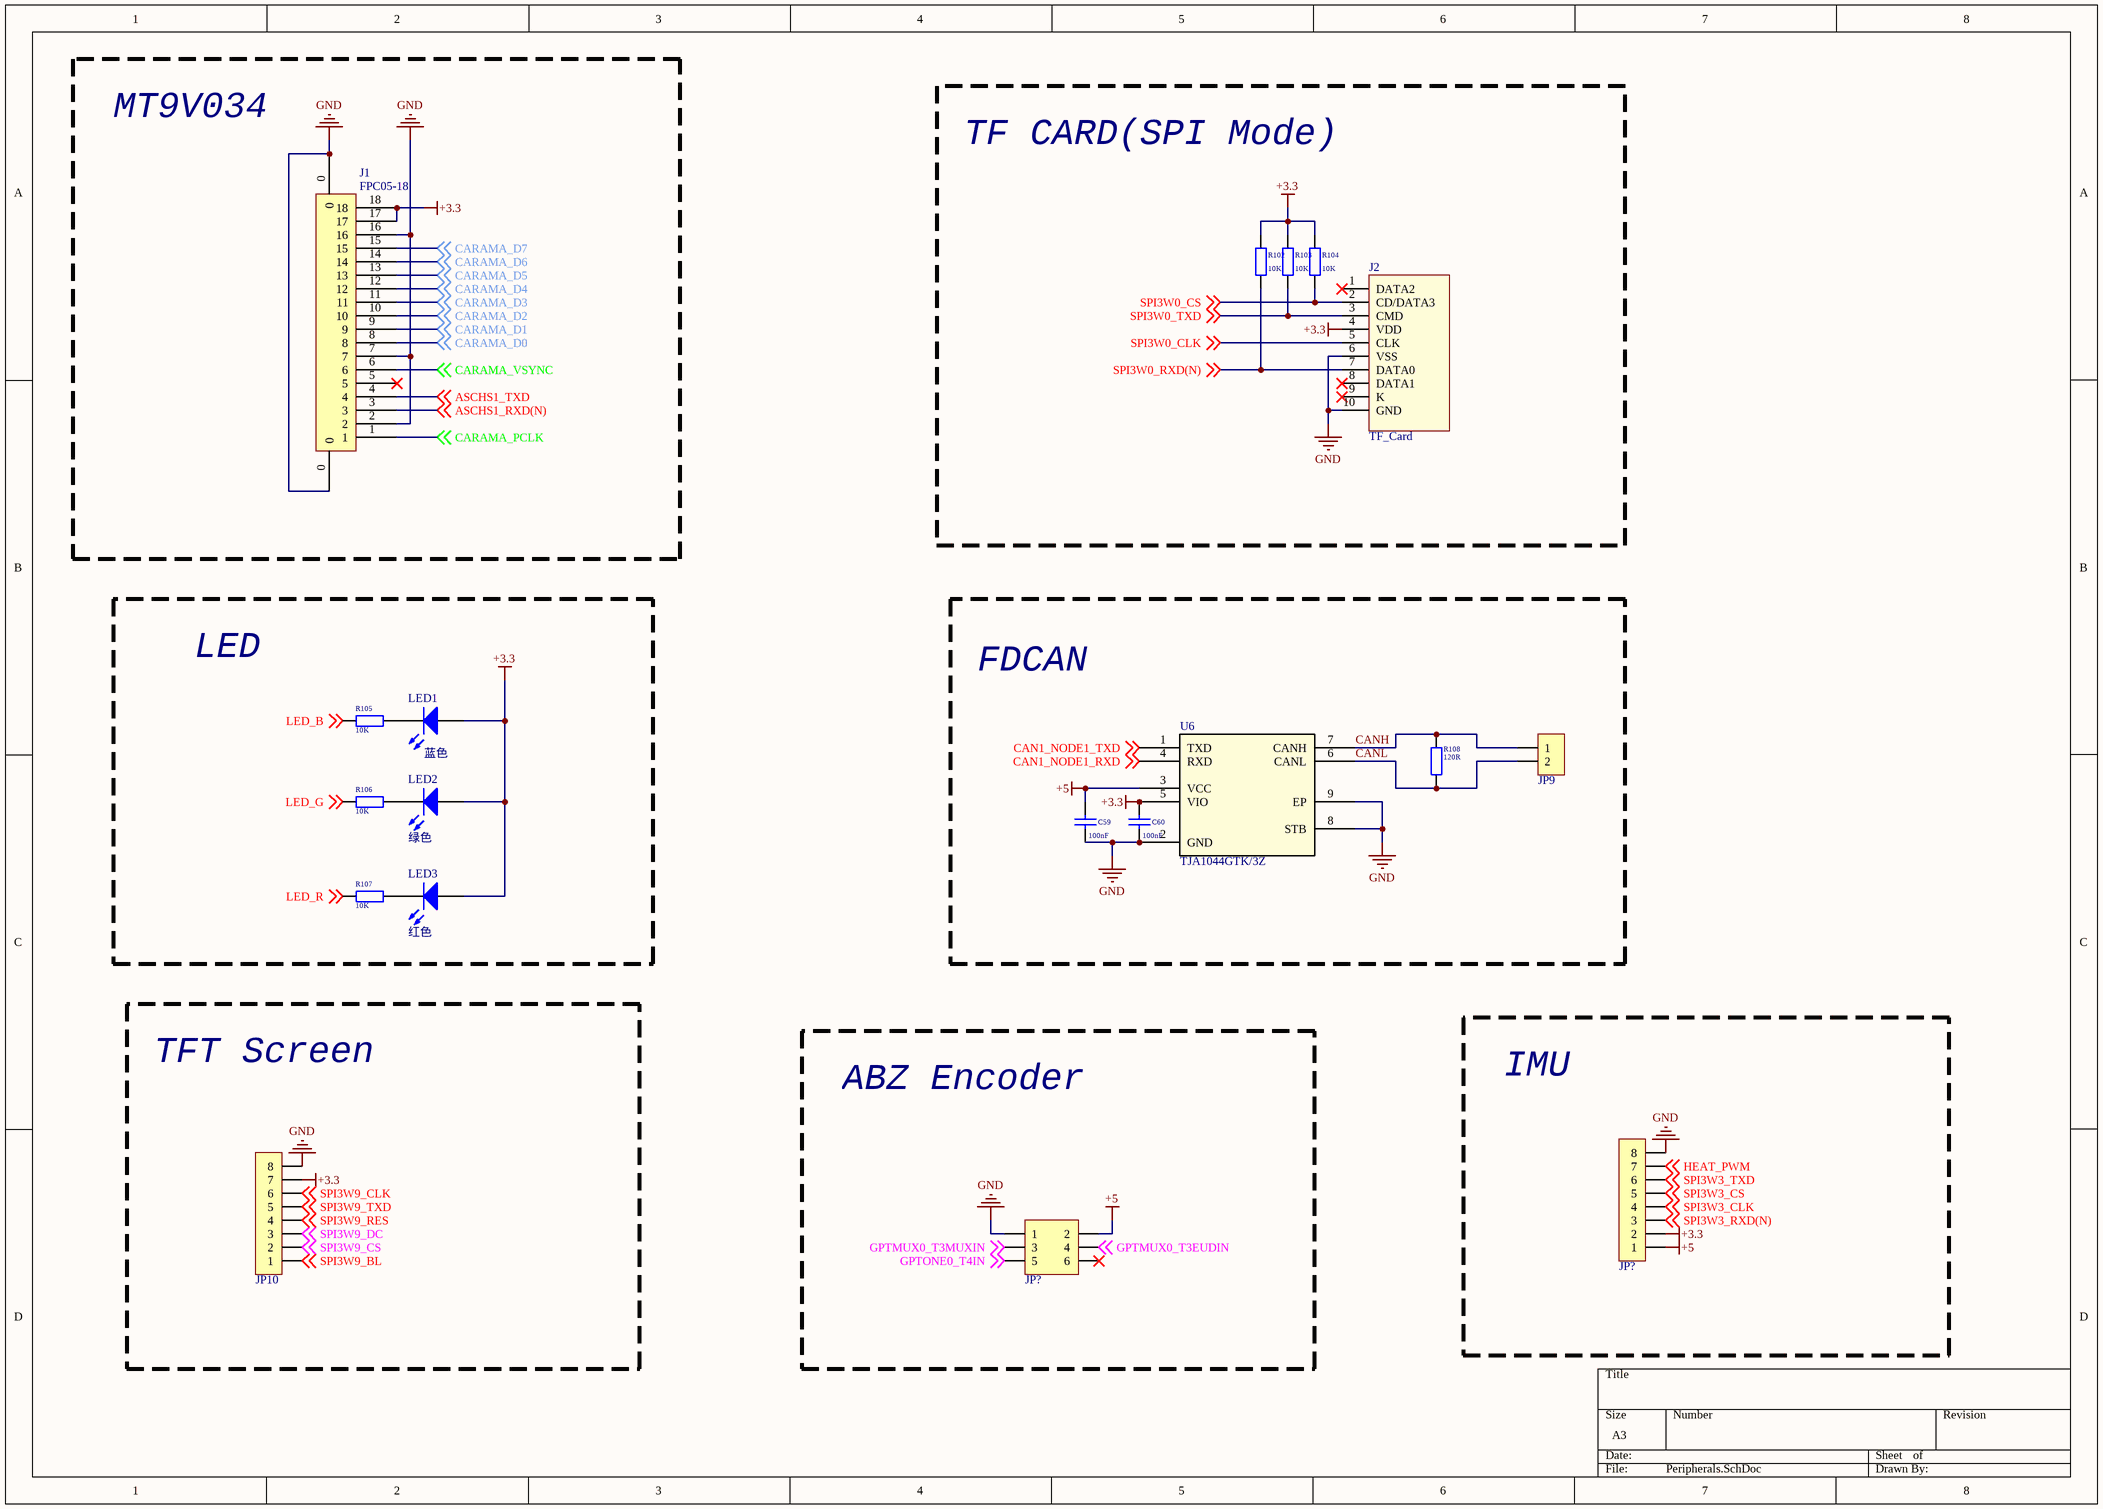
[diagram p6: Peripherals.SchDoc]

### Parts
(Parts that share a designator on the sheet are numbered #1, #2 ... from top to bottom, then left to right.)
C59  100nF  [C0402_L]
C60  100nF  [C0402_L]
J1  FPC05-18  [fpc_05_18p]
J2  TF_Card  [Micro SD]
JP9  HDR-1X2  [GH1.25-WT-2P]  (value not drawn)
JP10  HDR-1X8  [MX1.25-WT-8P]  (value not drawn)
JP?#7  Header3X2  [IDC2.54-LI-2x3P]  (value not drawn)
JP?#8  HDR-1X8  [MX1.25-WT-8P]  (value not drawn)
LED1  蓝色  [LED0402_B]
LED2  绿色  [LED0402_G]
LED3  红色  [LED0402_R]
R102  10K  [R0402_L]
R103  10K  [R0402_L]
R104  10K  [R0402_L]
R105  10K  [R0402_L]
R106  10K  [R0402_L]
R107  10K  [R0402_L]
R108  120R  [R0402_L]
U6  TJA1044GTK/3Z  [SON8_TJA1044GTK3Z_NXP]

### Blocks framed on the sheet
MT9V034: J1
TF CARD(SPI Mode): J2 R102-R104
LED: LED1-LED3 R105-R107
FDCAN: C59 C60 JP9 R108 U6
TFT Screen: JP10
ABZ Encoder: JP?#7
IMU: JP?#8

### Nets
+3.3: C60.2 J1.17 J1.18 J2.4(VDD) JP10.7 JP?#8.2 LED1.1(A) LED2.1(A) LED3.1(A) R102.2 R103.2 R104.2 U6.5(VIO)
+5: C59.2 JP?#7.2 JP?#8.1 U6.3(VCC)
GND: C59.1 C60.1 J1.0 J1.2 J1.7 J1.16 J2.6(VSS) J2.10(GND) JP10.8 JP?#7.1 JP?#8.8 U6.2(GND) U6.8(STB) U6.9(EP)
ASCHS1_RXD(N): J1.3 ; off-sheet ASCHS1_RXD(N)
ASCHS1_TXD: J1.4 ; off-sheet ASCHS1_TXD
CAN1_NODE1_RXD: U6.4(RXD) ; off-sheet CAN1_NODE1_RXD
CAN1_NODE1_TXD: U6.1(TXD) ; off-sheet CAN1_NODE1_TXD
CANH: JP9.1 R108.1 U6.7(CANH)
CANL: JP9.2 R108.2 U6.6(CANL)
CARAMA_D0: J1.8 ; off-sheet CARAMA_D0
CARAMA_D1: J1.9 ; off-sheet CARAMA_D1
CARAMA_D2: J1.10 ; off-sheet CARAMA_D2
CARAMA_D3: J1.11 ; off-sheet CARAMA_D3
CARAMA_D4: J1.12 ; off-sheet CARAMA_D4
CARAMA_D5: J1.13 ; off-sheet CARAMA_D5
CARAMA_D6: J1.14 ; off-sheet CARAMA_D6
CARAMA_D7: J1.15 ; off-sheet CARAMA_D7
CARAMA_PCLK: J1.1 ; off-sheet CARAMA_PCLK
CARAMA_VSYNC: J1.6 ; off-sheet CARAMA_VSYNC
GPTMUX0_T3EUDIN: JP?#7.4 ; off-sheet GPTMUX0_T3EUDIN
GPTMUX0_T3MUXIN: JP?#7.3 ; off-sheet GPTMUX0_T3MUXIN
GPTONE0_T4IN: JP?#7.5 ; off-sheet GPTONE0_T4IN
HEAT_PWM: JP?#8.7 ; off-sheet HEAT_PWM
LED_B: R105.2 ; off-sheet LED_B
LED_G: R106.2 ; off-sheet LED_G
LED_R: R107.2 ; off-sheet LED_R
SPI3W0_CLK: J2.5(CLK) ; off-sheet SPI3W0_CLK
SPI3W0_CS: J2.2(CD/DATA3) R104.1 ; off-sheet SPI3W0_CS
SPI3W0_RXD(N): J2.7(DATA0) R102.1 ; off-sheet SPI3W0_RXD(N)
SPI3W0_TXD: J2.3(CMD) R103.1 ; off-sheet SPI3W0_TXD
SPI3W3_CLK: JP?#8.4 ; off-sheet SPI3W3_CLK
SPI3W3_CS: JP?#8.5 ; off-sheet SPI3W3_CS
SPI3W3_RXD(N): JP?#8.3 ; off-sheet SPI3W3_RXD(N)
SPI3W3_TXD: JP?#8.6 ; off-sheet SPI3W3_TXD
SPI3W9_BL: JP10.1 ; off-sheet SPI3W9_BL
SPI3W9_CLK: JP10.6 ; off-sheet SPI3W9_CLK
SPI3W9_CS: JP10.2 ; off-sheet SPI3W9_CS
SPI3W9_DC: JP10.3 ; off-sheet SPI3W9_DC
SPI3W9_RES: JP10.4 ; off-sheet SPI3W9_RES
SPI3W9_TXD: JP10.5 ; off-sheet SPI3W9_TXD
NetLED1_2: LED1.2(K) R105.1
NetLED2_2: LED2.2(K) R106.1
NetLED3_2: LED3.2(K) R107.1

Not connected (* = marked no-connect by the designer): J1 5*; J2 1(DATA2)* 8(DATA1)* 9(K)*; JP?#7 6*

### Library data of the parts
C59 C60 = CMP-002-000000-1: as C37 on sheet TC387; Design Item ID: C; Source: 0.1 - 电阻-电容-电感-保险丝-晶振-晶体-磁珠-电位器-法拉电容-馈通电容.SchLib
J2 = TF_Card: TF卡座; 当前库版本V2023.5.31 @淘宝卖家:黄晶宝石: 最新版本发布https://shop463601444.taobao.com; BOM名称: TF卡座
JP9 = Header 2: 2P连接器; 联系卖家 免费技术支持: 封装库来自淘宝卖家ID：黄晶宝石; BOM名称: 2P连接器
JP10 JP?#8 = Header 8: 8P连接器; 联系卖家 免费技术支持: 封装库来自淘宝卖家ID：黄晶宝石; BOM名称: 8P连接器
JP?#7 = Header 3X2: 3*2P接插件; 联系卖家，免费查找封装: 唯一出售店铺网址https://shop463601444.taobao.com; 封装库来自淘宝卖家ID：黄晶宝石: 其他店铺购入均为盗版封装库，请立即申请退款，本店现金奖励50~200元; BOM名称: 3*2P接插件
LED1-LED3 = LED: 贴片LED; 封装库来自淘宝卖家：黄晶宝石: 其他店铺购入均为盗版封装库，无更新权益，请立即申请退款，本店现金奖励200~1000元; BOM名称: 贴片LED
R102-R108 = CMP-005-000000-2: as R87 on sheet PWR; Source: 0.1 - 电阻-电容-电感-保险丝-晶振-晶体-磁珠-电位器-法拉电容-馈通电容.SchLib; Design Item ID: R
U6 = CMP-00028-4: CAN High Speed Transceiver 1Mbps Normal/Standby 4.75V to 5.25V 8-Pin HVSON T/R

## Sheet FOC.SchDoc
size A3; SheetNumber: 1; SheetTotal: 6
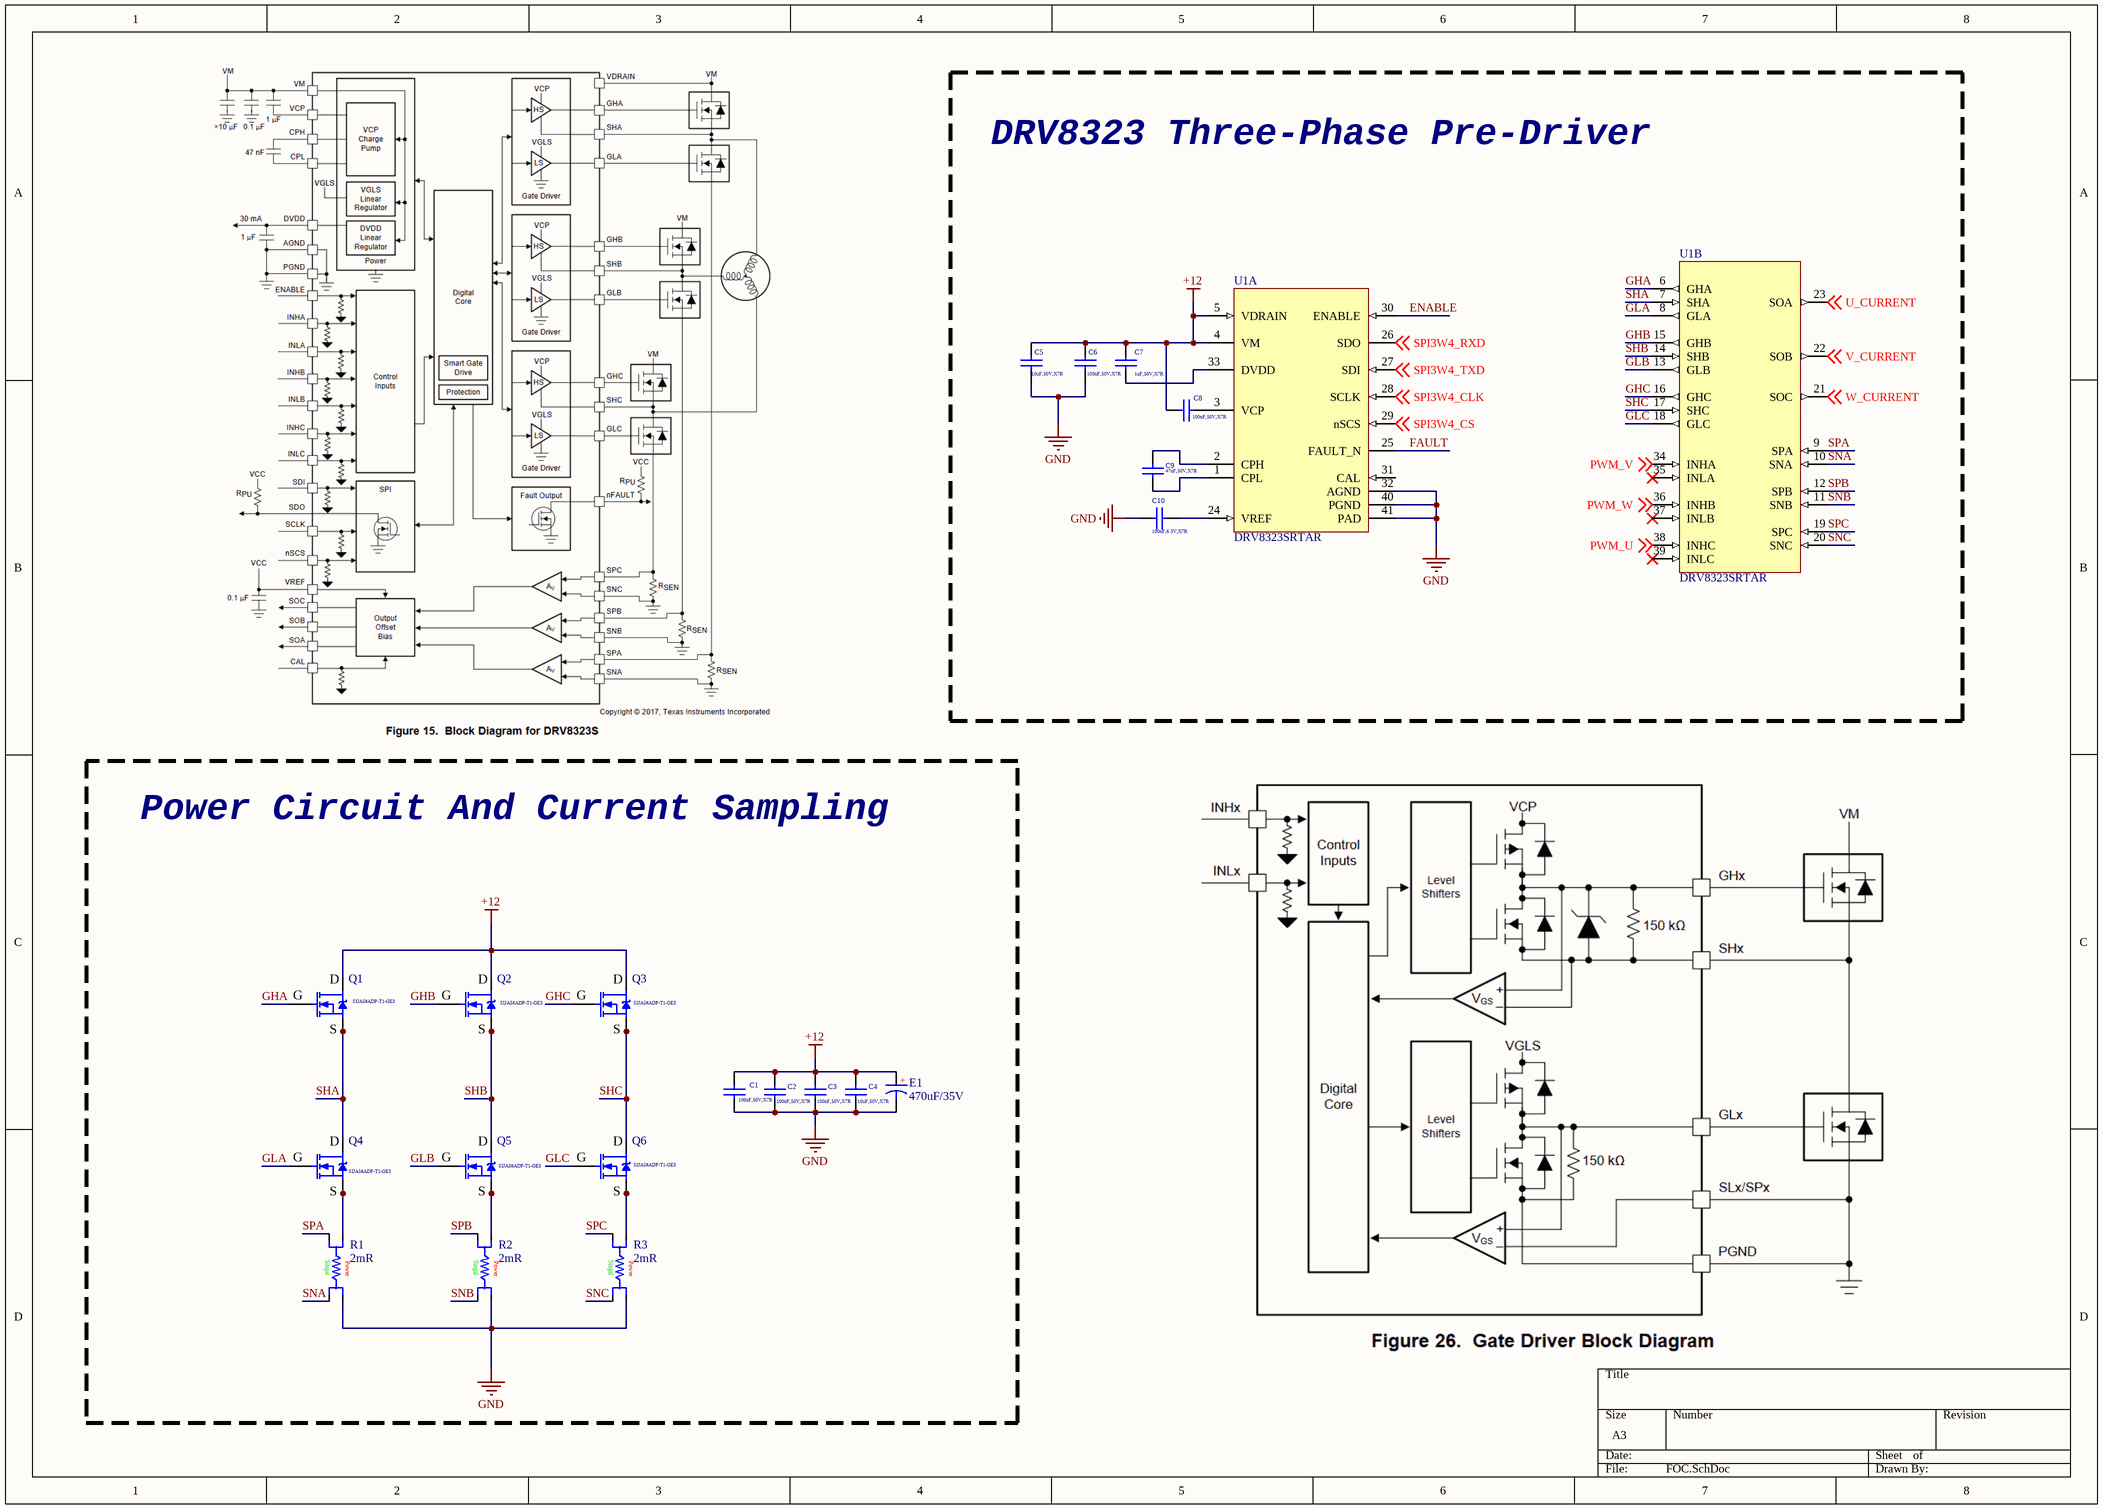
[diagram p7: FOC.SchDoc]

### Parts
C1  100nF,50V,X7R  [C0603_L]
C2  100nF,50V,X7R  [C0603_L]
C3  100nF,50V,X7R  [C0603_L]
C4  10uF,50V,X7R  [C0603_L]
C5  10uF,50V,X7R  [C0402_L]
C6  100nF,50V,X7R  [C0402_L]
C7  1uF,50V,X7R  [C0402_L]
C8  100nF,50V,X7R  [C0402_L]
C9  47nF,50V,X7R  [C0402_L]
C10  100nF,6.3V,X7R  [C0402_L]
E1  470uF/35V  [CE E(8*6.2)]
Q1  SIJA58ADP-T1-GE3  [POWERPAK SO-8L_VIS]
Q2  SIJA58ADP-T1-GE3  [POWERPAK SO-8L_VIS]
Q3  SIJA58ADP-T1-GE3  [POWERPAK SO-8L_VIS]
Q4  SIJA58ADP-T1-GE3  [POWERPAK SO-8L_VIS]
Q5  SIJA58ADP-T1-GE3  [POWERPAK SO-8L_VIS]
Q6  SIJA58ADP-T1-GE3  [POWERPAK SO-8L_VIS]
R1  2mR  [WSKW0612_VIS]
R2  2mR  [WSKW0612_VIS]
R3  2mR  [WSKW0612_VIS]
U1  DRV8323SRTAR  [DRV8323SRTAR-Footprint-1]  (parts A,B of 2)

### Blocks framed on the sheet
DRV8323 Three-Phase Pre-Driver: C5-C10 U1
Power Circuit And Current Sampling: C1-C4 E1 Q1-Q6 R1-R3

### Nets
+12: C1.1 C2.1 C3.1 C4.1 C5.2 C6.2 C7.1 C8.1 E1.1 Q1.5(D) Q2.5(D) Q3.5(D) U1.4(VM) U1.5(VDRAIN)
GND: C1.2 C2.2 C3.2 C4.2 C5.1 C6.1 C10.1 E1.2 R1.4 R2.4 R3.4 U1.32(AGND) U1.40(PGND) U1.41(PAD)
ENABLE: U1.30(ENABLE)
FAULT: U1.25(FAULT_N)
GHA: Q1.4(G) U1.6(GHA)
GHB: Q2.4(G) U1.15(GHB)
GHC: Q3.4(G) U1.16(GHC)
GLA: Q4.4(G) U1.8(GLA)
GLB: Q5.4(G) U1.13(GLB)
GLC: Q6.4(G) U1.18(GLC)
PWM_U: U1.38(INHC) ; off-sheet PWM_U
PWM_V: U1.34(INHA) ; off-sheet PWM_V
PWM_W: U1.36(INHB) ; off-sheet PWM_W
SHA: Q1.1(S) Q1.2(S) Q1.3(S) Q4.5(D) U1.7(SHA)
SHB: Q2.1(S) Q2.2(S) Q2.3(S) Q5.5(D) U1.14(SHB)
SHC: Q3.1(S) Q3.2(S) Q3.3(S) Q6.5(D) U1.17(SHC)
SNA: R1.3 U1.10(SNA)
SNB: R2.3 U1.11(SNB)
SNC: R3.3 U1.20(SNC)
SPA: R1.2 U1.9(SPA)
SPB: R2.2 U1.12(SPB)
SPC: R3.2 U1.19(SPC)
SPI3W4_CLK: U1.28(SCLK) ; off-sheet SPI3W4_CLK
SPI3W4_CS: U1.29(nSCS) ; off-sheet SPI3W4_CS
SPI3W4_RXD: U1.26(SDO) ; off-sheet SPI3W4_RXD
SPI3W4_TXD: U1.27(SDI) ; off-sheet SPI3W4_TXD
U_CURRENT: U1.23(SOA) ; off-sheet U_CURRENT
V_CURRENT: U1.22(SOB) ; off-sheet V_CURRENT
W_CURRENT: U1.21(SOC) ; off-sheet W_CURRENT
NetC7_2: C7.2 U1.33(DVDD)
NetC8_2: C8.2 U1.3(VCP)
NetC9_1: C9.1 U1.2(CPH)
NetC9_2: C9.2 U1.1(CPL)
NetC10_2: C10.2 U1.24(VREF)
NetQ4_1: Q4.1(S) Q4.2(S) Q4.3(S) R1.1
NetQ5_1: Q5.1(S) Q5.2(S) Q5.3(S) R2.1
NetQ6_1: Q6.1(S) Q6.2(S) Q6.3(S) R3.1

Not connected (* = marked no-connect by the designer): U1 31(CAL) 35(INLA)* 37(INLB)* 39(INLC)*

### Notes on the sheet
- (in symbol CE_SMD) +
- (in symbol CMP-00060-2) Singal; Power

### Library data of the parts
C1-C10 = C: as C38 on sheet PWR
E1 = CE_SMD: 贴片电解电容; 当前库版本V2023.5.31 @淘宝卖家:黄晶宝石: 最新版本发布https://item.taobao.com/item.htm?id=566775463719; BOM名称: 贴片电解电容
Q1-Q6 = CMP-00055-2: Power Field-Effect Transistor
R1-R3 = CMP-00060-2: SMD Chip Resistor, 2 MOhm, ± 1%, 1 W, 0612 [1632 Metric], Metal Strip, High Power
U1 = CMP-00062-1: 65-V max 3-phase smart gate driver with current shunt amplifiers 40-WQFN -40 to 125

## Nets that join several sheets
+3.3: PWR (9 pins), TC387_PWR (22 pins), TC387 (6 pins), Carama (JP12.3 JP13.1), Peripherals (13 pins)
+5: PWR (11 pins), Carama (6 pins), Peripherals (C59.2 JP?#7.2 JP?#8.1 U6.3)
+12: PWR (9 pins), FOC (14 pins)
A3.3V: PWR (C51.2 C52.2 U4.2), TC387_PWR (6 pins)
GND: PWR (27 pins), TC387_PWR (89 pins), TC387 (C37.2 R40.2 SW1.3), Carama (11 pins), Peripherals (14 pins), FOC (14 pins)
ASCHS1_RXD(N): TC387 (R51.1), Peripherals (J1.3)
ASCHS1_TXD: TC387 (R49.1), Peripherals (J1.4)
ASCHS5_RXD: TC387 (R62.1), Carama (JP?#6.2)
ASCHS5_TXD: TC387 (R59.1), Carama (JP?#6.1)
ASCHS6_RXD(N): TC387 (R63.2), Carama (JP13.9)
ASCHS6_TXD: TC387 (R66.2), Carama (JP13.7)
ASCHS7_RXD(N): TC387 (R65.1), Carama (JP?#5.1)
ASCHS7_TXD: TC387 (R57.1), Carama (JP?#5.2)
ASCHS8_RXD(N): TC387 (R76.2), Carama (JP?#3.1)
ASCLIN8_TXD: TC387 (R86.1), Carama (JP?#3.2)
CAN1_NODE1_RXD: TC387 (U2.R16), Peripherals (U6.4)
CAN1_NODE1_TXD: TC387 (U2.R17), Peripherals (U6.1)
CARAMA_D0: TC387 (R7.1), Peripherals (J1.8)
CARAMA_D1: TC387 (R9.1), Peripherals (J1.9)
CARAMA_D2: TC387 (R12.1), Peripherals (J1.10)
CARAMA_D3: TC387 (R15.1), Peripherals (J1.11)
CARAMA_D4: TC387 (R17.1), Peripherals (J1.12)
CARAMA_D5: TC387 (R19.1), Peripherals (J1.13)
CARAMA_D6: TC387 (R21.1), Peripherals (J1.14)
CARAMA_D7: TC387 (R23.1), Peripherals (J1.15)
CARAMA_PCLK: TC387 (R47.1), Peripherals (J1.1)
CARAMA_VSYNC: TC387 (R48.1), Peripherals (J1.6)
DAP2P_DAP0IN: TC387 (R43.1), Carama (JP13.4)
DAP2P_DAP1IN: TC387 (R46.1), Carama (JP13.2)
DAP2P_TRST: TC387 (R42.1), Carama (JP13.8)
GPTMUX0_T3EUDIN: TC387 (R55.1), Peripherals (JP?#7.4)
GPTMUX0_T3MUXIN: TC387 (R53.1), Peripherals (JP?#7.3)
GPTONE0_T4IN: TC387 (R56.1), Peripherals (JP?#7.5)
HEAT_PWM: TC387 (R34.2), Peripherals (JP?#8.7)
I2C0_SCLIN: TC387 (R39.1), Carama (JP11.2)
I2C0_SDA1: TC387 (R41.1), Carama (JP11.1)
I2C1_SCL0: TC387 (R72.2), Carama (JP12.1)
I2C1_SDA0: TC387 (R70.2), Carama (JP12.2)
LED_B: TC387 (U2.G20), Peripherals (R105.2)
LED_G: TC387 (U2.F20), Peripherals (R106.2)
LED_R: TC387 (U2.E20), Peripherals (R107.2)
MOTOR_DIR: TC387 (R31.2), Carama (JP?#4.2)
MOTOR_PWM: TC387 (R32.2), Carama (JP?#4.3)
NRST: TC387 (C37.1 R75.2 SW1.4 U2.G17), Carama (JP13.10)
PWM_U: TC387 (R80.2), FOC (U1.38)
PWM_V: TC387 (R82.2), FOC (U1.34)
PWM_W: TC387 (R84.2), FOC (U1.36)
SERVO_PWM: TC387 (R29.2), Carama (JP?#1.3)
SPI3W0_CLK: TC387 (R25.2), Peripherals (J2.5)
SPI3W0_CS: TC387 (R30.2), Peripherals (J2.2 R104.1)
SPI3W0_RXD(N): TC387 (R27.2), Peripherals (J2.7 R102.1)
SPI3W0_TXD: TC387 (R35.2), Peripherals (J2.3 R103.1)
SPI3W2_CLK: TC387 (R77.2), Carama (JP?#2.5)
SPI3W2_CS: TC387 (R73.1), Carama (JP?#2.3)
SPI3W2_RXD(N): TC387 (R74.1), Carama (JP?#2.2)
SPI3W2_TXD: TC387 (R78.2), Carama (JP?#2.4)
SPI3W3_CLK: TC387 (R68.2), Peripherals (JP?#8.4)
SPI3W3_CS: TC387 (R71.2), Peripherals (JP?#8.5)
SPI3W3_RXD(N): TC387 (R61.2), Peripherals (JP?#8.3)
SPI3W3_TXD: TC387 (R64.2), Peripherals (JP?#8.6)
SPI3W4_CLK: TC387 (R83.1), FOC (U1.28)
SPI3W4_CS: TC387 (R85.1), FOC (U1.29)
SPI3W4_RXD: TC387 (R81.1), FOC (U1.26)
SPI3W4_TXD: TC387 (R79.1), FOC (U1.27)
SPI3W9_BL: TC387 (R8.2), Peripherals (JP10.1)
SPI3W9_CLK: TC387 (R16.2), Peripherals (JP10.6)
SPI3W9_CS: TC387 (R60.1), Peripherals (JP10.2)
SPI3W9_DC: TC387 (R58.1), Peripherals (JP10.3)
SPI3W9_RES: TC387 (R10.2), Peripherals (JP10.4)
SPI3W9_TXD: TC387 (R18.2), Peripherals (JP10.5)
TDO: TC387 (R45.1), Carama (JP13.6)
U_CURRENT: TC387 (R26.2), FOC (U1.23)
V_CURRENT: TC387 (R28.2), FOC (U1.22)
W_CURRENT: TC387 (R24.2), FOC (U1.21)